# Altium project CW342_KintexK410_676.PrjPcb (part 1 of 2)
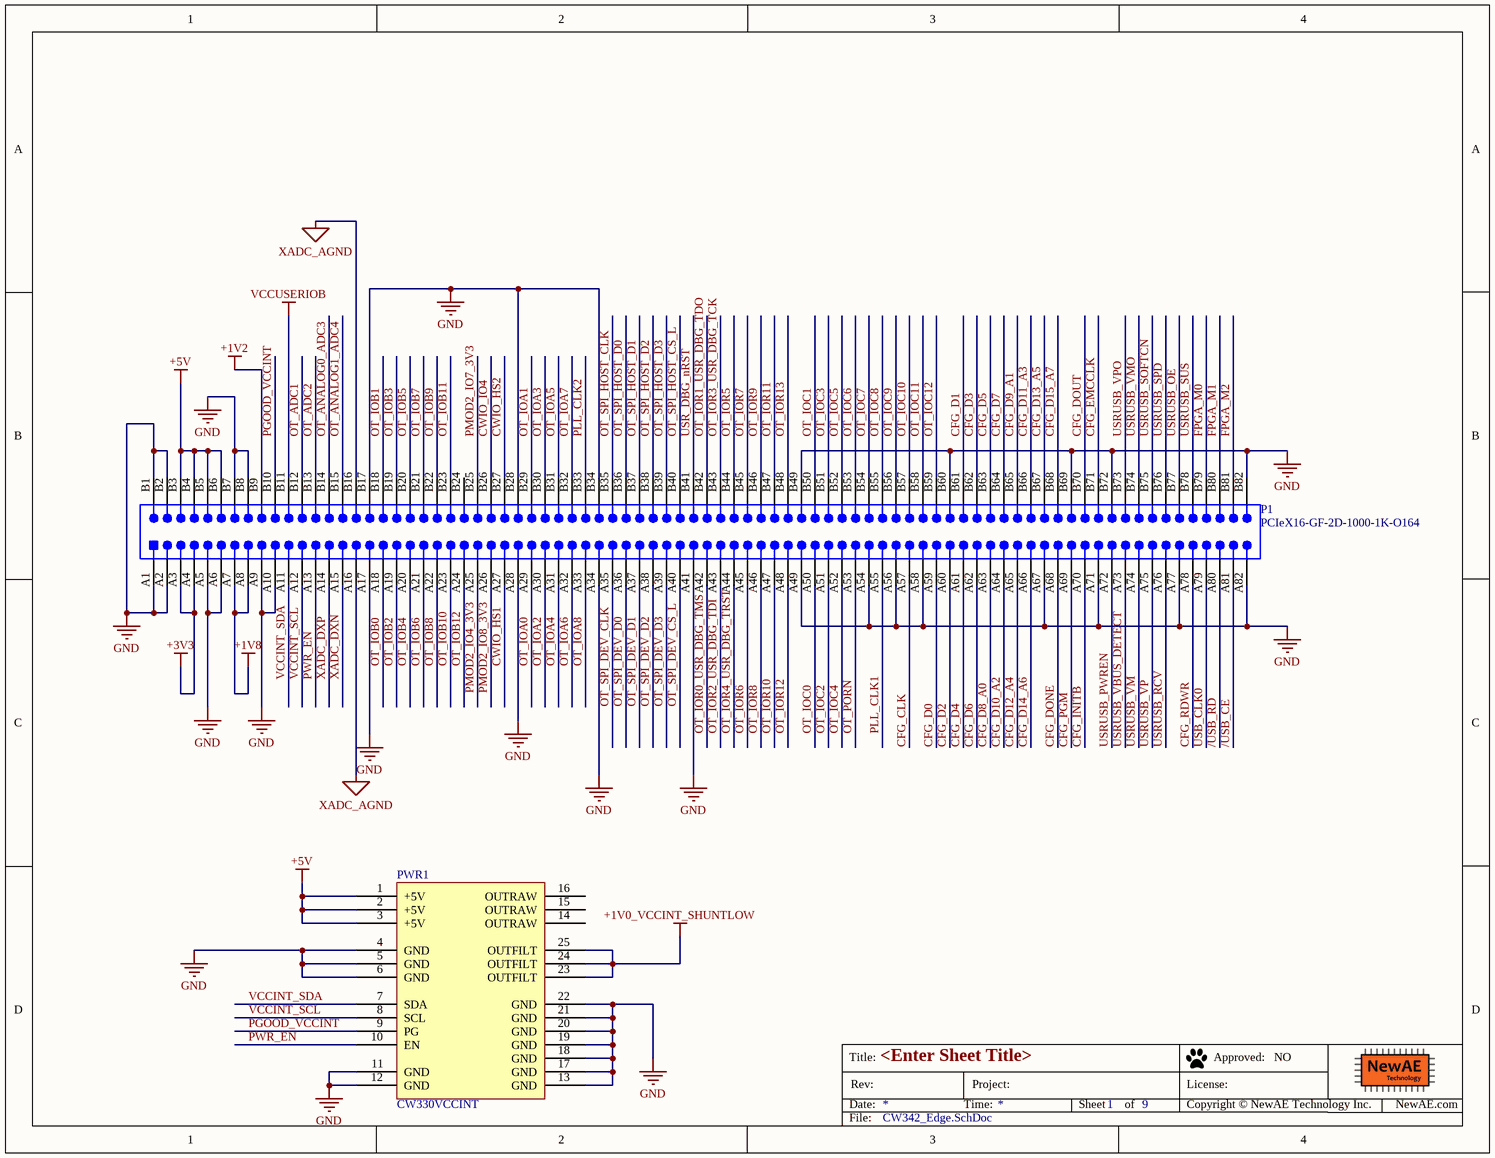
[diagram p0: CW342_Edge.SchDoc]
9 sheets, 90 parts. Net scope: global (net labels, ports and power ports of the same name join across sheets).
Board file: CW342_PCB.PcbDoc
Sheets:
  CW342_Edge.SchDoc
  CW342_XADC.SchDoc
  CW342_FPGAIO_1.SchDoc
  CW342_FPGIO_2.SchDoc
  CW342_FPGAIO_3.SchDoc
  CW342_FPGA_MGT.SchDoc
  CW342_FPGA_CFG.SchDoc
  CW342_FPGA_PWR.SchDoc
  CW342_FPGA_DECOUP.SchDoc

## Sheet CW342_Edge.SchDoc: <Enter Sheet Title>
size Letter; Organization: NewAE Technology Inc.; Address1: 1083 Queen St., Suite 196; Address2: Halifax; Address3: NS; Address4: Canada B3H 0B2; SheetNumber: 1; SheetTotal: 9; SheetApproved: NO

### Parts
P1  PCIeX16-GF-2D-1000-1K-O164  [PCIeX16-GF-2D-1000-1K-O164]
PWR1  CW330VCCINT  [CW335_VCCINT_POWERSUPPLY]

### Nets
+1V0_VCCINT_SHUNTLOW: PWR1.23(OUTFILT) PWR1.24(OUTFILT) PWR1.25(OUTFILT)
+1V2: P1.B9
+1V8: P1.A7 P1.A8
+3V3: P1.A3 P1.A4
+5V: P1.B3 P1.B4 P1.B5 P1.B6 PWR1.1(+5V) PWR1.2(+5V) PWR1.3(+5V)
GND: P1.A1 P1.A2 P1.A5 P1.A6 P1.A9 P1.A10 P1.A17 P1.A28 P1.A34 P1.A41 P1.A49 P1.A54 P1.A56 P1.A58 P1.A67 P1.A71 P1.A77 P1.A82 P1.B1 P1.B2 P1.B7 P1.B8 P1.B17 P1.B28 P1.B34 P1.B49 P1.B60 P1.B69 P1.B72 P1.B82 PWR1.4(GND) PWR1.5(GND) PWR1.6(GND) PWR1.11(GND) PWR1.12(GND) PWR1.13(GND) PWR1.17(GND) PWR1.18(GND) PWR1.19(GND) PWR1.20(GND) PWR1.21(GND) PWR1.22(GND)
VCCUSERIOB: P1.B11
XADC_AGND: P1.A16 P1.B16  [project net XADC_VREFN]
/USB_CE: P1.A81
/USB_RD: P1.A80
CFG_CLK: P1.A57
CFG_D0: P1.A59
CFG_D1: P1.B61
CFG_D2: P1.A60
CFG_D3: P1.B62
CFG_D4: P1.A61
CFG_D5: P1.B63
CFG_D6: P1.A62
CFG_D7: P1.B64
CFG_D8_A0: P1.A63
CFG_D9_A1: P1.B65
CFG_D10_A2: P1.A64
CFG_D11_A3: P1.B66
CFG_D12_A4: P1.A65
CFG_D13_A5: P1.B67
CFG_D14_A6: P1.A66
CFG_D15_A7: P1.B68
CFG_DONE: P1.A68
CFG_DOUT: P1.B70
CFG_EMCCLK: P1.B71
CFG_INITB: P1.A70
CFG_PGM: P1.A69
CFG_RDWR: P1.A78
CWIO_HS1: P1.A27
CWIO_HS2: P1.B27
CWIO_IO4: P1.B26
FPGA_M0: P1.B79
FPGA_M1: P1.B80
FPGA_M2: P1.B81
OT_ADC1: P1.B12
OT_ADC2: P1.B13
OT_ANALOG0_ADC3: P1.B14
OT_ANALOG1_ADC4: P1.B15
OT_IOA0: P1.A29
OT_IOA1: P1.B29
OT_IOA2: P1.A30
OT_IOA3: P1.B30
OT_IOA4: P1.A31
OT_IOA5: P1.B31
OT_IOA6: P1.A32
OT_IOA7: P1.B32
OT_IOA8: P1.A33
OT_IOB0: P1.A18
OT_IOB1: P1.B18
OT_IOB2: P1.A19
OT_IOB3: P1.B19
OT_IOB4: P1.A20
OT_IOB5: P1.B20
OT_IOB6: P1.A21
OT_IOB7: P1.B21
OT_IOB8: P1.A22
OT_IOB9: P1.B22
OT_IOB10: P1.A23
OT_IOB11: P1.B23
OT_IOB12: P1.A24
OT_IOC0: P1.A50
OT_IOC1: P1.B50
OT_IOC2: P1.A51
OT_IOC3: P1.B51
OT_IOC4: P1.A52
OT_IOC5: P1.B52
OT_IOC6: P1.B53
OT_IOC7: P1.B54
OT_IOC8: P1.B55
OT_IOC9: P1.B56
OT_IOC10: P1.B57
OT_IOC11: P1.B58
OT_IOC12: P1.B59
OT_IOR0_USR_DBG_TMS: P1.A42
OT_IOR1_USR_DBG_TDO: P1.B42
OT_IOR2_USR_DBG_TDI: P1.A43
OT_IOR3_USR_DBG_TCK: P1.B43
OT_IOR4_USR_DBG_TRST: P1.A44
OT_IOR5: P1.B44
OT_IOR6: P1.A45
OT_IOR7: P1.B45
OT_IOR8: P1.A46
OT_IOR9: P1.B46
OT_IOR10: P1.A47
OT_IOR11: P1.B47
OT_IOR12: P1.A48
OT_IOR13: P1.B48
OT_PORN: P1.A53
OT_SPI_DEV_CLK: P1.A35
OT_SPI_DEV_CS_L: P1.A40
OT_SPI_DEV_D0: P1.A36
OT_SPI_DEV_D1: P1.A37
OT_SPI_DEV_D2: P1.A38
OT_SPI_DEV_D3: P1.A39
OT_SPI_HOST_CLK: P1.B35
OT_SPI_HOST_CS_L: P1.B40
OT_SPI_HOST_D0: P1.B36
OT_SPI_HOST_D1: P1.B37
OT_SPI_HOST_D2: P1.B38
OT_SPI_HOST_D3: P1.B39
PGOOD_VCCINT: P1.B10 PWR1.9(PG)
PLL_CLK1: P1.A55
PLL_CLK2: P1.B33
PMOD2_IO4_3V3: P1.A25
PMOD2_IO7_3V3: P1.B25
PMOD2_IO8_3V3: P1.A26
PWR_EN: P1.A13 PWR1.10(EN)
USB_CLK0: P1.A79
USR_DBG_nRST: P1.B41
USRUSB_OE: P1.B77
USRUSB_PWREN: P1.A72
USRUSB_RCV: P1.A76
USRUSB_SOFTCN: P1.B75
USRUSB_SPD: P1.B76
USRUSB_SUS: P1.B78
USRUSB_VBUS_DETECT: P1.A73
USRUSB_VM: P1.A74
USRUSB_VMO: P1.B74
USRUSB_VP: P1.A75
USRUSB_VPO: P1.B73
VCCINT_SCL: P1.A12 PWR1.8(SCL)
VCCINT_SDA: P1.A11 PWR1.7(SDA)
XADC_DXN: P1.A15
XADC_DXP: P1.A14

Not connected (* = marked no-connect by the designer): P1 B24; PWR1 14(OUTRAW) 15(OUTRAW) 16(OUTRAW)

### Notes on the sheet
- Title:
- Date:
- Rev:
- Time:
- Project:
- Sheet
- of
- License:
- Copyright © NewAE Technology Inc.
- Approved:
- NewAE.com
- File:

### Library data of the parts
P1 = CMP-002-00047-1: Golden Finger, PCIeX16, Dual, Opposite, Pitch 1mm, 164-Position; Connector Type: EdgeConnector; Gender: Male; Mounting Technology: SM; Pins: 164; Case/Package: PCIeX16-GF-2D-1000-1K-O164; Package Description: Edge Connector, Golden Finger, Pitch 1 mm, 2 x 82 Position; Package Reference: PCIeX16-GF-2D-1000-1K-O164

## Sheet CW342_XADC.SchDoc: <Enter Sheet Title>
size Letter; Organization: NewAE Technology Inc.; Address1: 1083 Queen St., Suite 196; Address2: Halifax; Address3: NS; Address4: Canada B3H 0B2; SheetNumber: 2; SheetTotal: 9; SheetApproved: NO
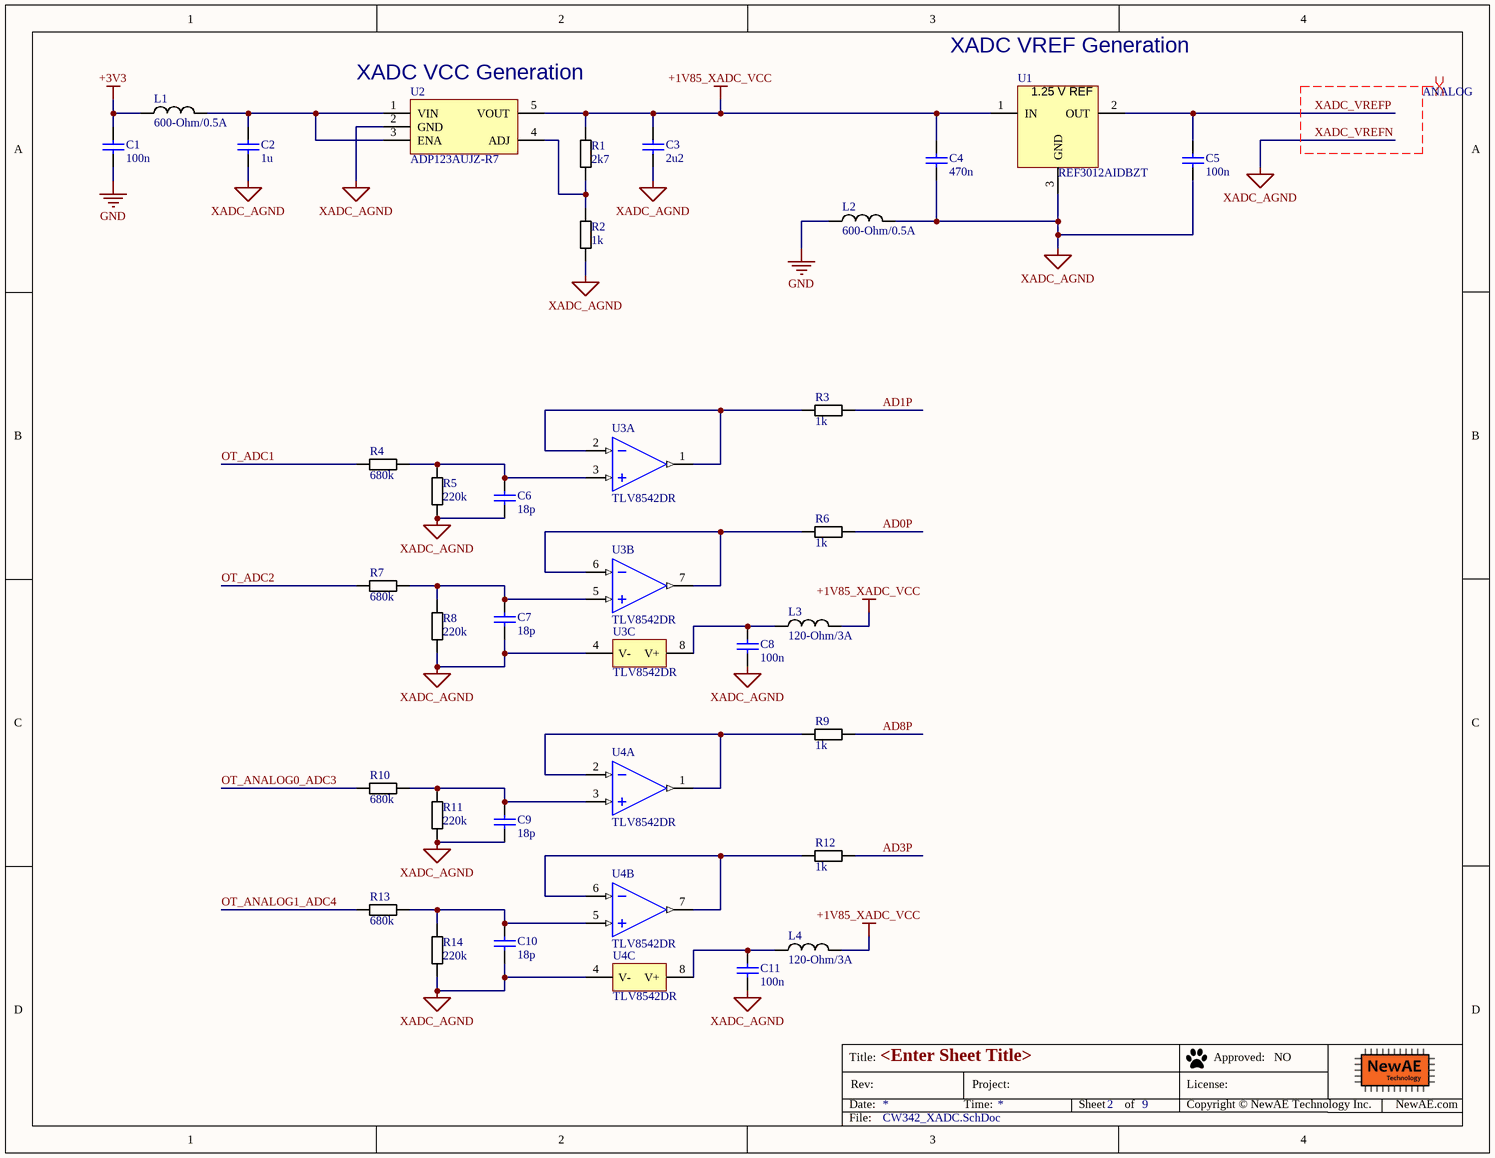
[diagram p1: CW342_XADC.SchDoc]

### Parts
C1  100n  [CAPC0402_M]
C2  1u  [CAPC0603_M]
C3  2u2  [CAPC0603_M]
C4  470n  [CAPC0603_M]
C5  100n  [CAPC0402_M]
C6  18p  [CAPC0402_M]
C7  18p  [CAPC0402_M]
C8  100n  [CAPC0402_M]
C9  18p  [CAPC0402_M]
C10  18p  [CAPC0402_M]
C11  100n  [CAPC0402_M]
L1  600-Ohm/0.5A  [IND_0603]
L2  600-Ohm/0.5A  [IND_0603]
L3  120-Ohm/3A  [IND_0603]
L4  120-Ohm/3A  [IND_0603]
R1  2k7  [RESC1005X40N]
R2  1k  [RESC1005X40N]
R3  1k  [RESC1005X40N]
R4  680k  [RESC1005X40N]
R5  220k  [RESC1005X40N]
R6  1k  [RESC1005X40N]
R7  680k  [RESC1005X40N]
R8  220k  [RESC1005X40N]
R9  1k  [RESC1005X40N]
R10  680k  [RESC1005X40N]
R11  220k  [RESC1005X40N]
R12  1k  [RESC1005X40N]
R13  680k  [RESC1005X40N]
R14  220k  [RESC1005X40N]
U1  REF3012AIDBZT  [SOT95P237X112-3N]
U2  Linear Voltage Regulator IC  1 Output  300mA TSOT-5  [SOT23-5P95_285X145L45X40]  (value not drawn)
U3  TLV8542DR  [SOIC127P600X175-8N]  (parts A,B,C of 3)
U4  TLV8542DR  [SOIC127P600X175-8N]  (parts A,B,C of 3)

### Nets
+1V85_XADC_VCC: C3.1 C4.1 L3.2 L4.2 R1.1 U1.1(IN) U2.5(VOUT)
+3V3: C1.1 L1.1
GND: C1.2 L2.1
XADC_VREFN: C2.2 C3.2 C4.2 C5.2 C6.2 C7.2 C8.2 C9.2 C10.2 C11.2 L2.2 R2.2 R5.2 R8.2 R11.2 R14.2 U1.3(GND) U2.2(GND) U3.4(V-) U4.4(V-)  [also labelled XADC_AGND]
AD0P: R6.2
AD1P: R3.2
AD3P: R12.2
AD8P: R9.2
OT_ADC1: R4.1
OT_ADC2: R7.1
OT_ANALOG0_ADC3: R10.1
OT_ANALOG1_ADC4: R13.1
XADC_VREFP: C5.1 U1.2(OUT)
NetC2_1: C2.1 L1.2 U2.1(VIN) U2.3(ENA)
NetC6_1: C6.1 R4.2 R5.1 U3.3(1_IN+)
NetC7_1: C7.1 R7.2 R8.1 U3.5(2_IN+)
NetC8_1: C8.1 L3.1 U3.8(V+)
NetC9_1: C9.1 R10.2 R11.1 U4.3(1_IN+)
NetC10_1: C10.1 R13.2 R14.1 U4.5(2_IN+)
NetC11_1: C11.1 L4.1 U4.8(V+)
NetR1_2: R1.2 R2.1 U2.4(ADJ)
NetR3_1: R3.1 U3.1(1_Out) U3.2(1_IN-)
NetR6_1: R6.1 U3.6(2_IN-) U3.7(2_Out)
NetR9_1: R9.1 U4.1(1_Out) U4.2(1_IN-)
NetR12_1: R12.1 U4.6(2_IN-) U4.7(2_Out)

### Layout directives
differential pair; differential pair class ANALOG: XADC_VREFN, XADC_VREFP

### Notes on the sheet
- (near U2) XADC VCC Generation
- XADC VREF Generation
- Title:
- Date:
- Rev:
- Time:
- Project:
- Sheet
- of
- License:
- Copyright © NewAE Technology Inc.
- Approved:
- NewAE.com
- File:
- (in symbol REF3012AIDBZT) 1.25 V REF

### Library data of the parts
C1 C5 C8 C11 = CCHIP-100n-0402: 100n, 0402; Manufacture Part Number 1: CGA2B3X7R1V104K050BB; Component Group: Capacitor; Case-EIA: 0402; Part Number: CCHIP-100n-0402; Footprint: 0402; Pin Count: 2; Value: 100n; Mounting Technology: SMT; Component Kind: Standard; Component Type: Standard; Supplier 1: Digi-Key; Supplier Part Number 1: 445-6901-1-ND
C2 = CCHIP-1u-0603: 1u, 0603, 50V; Manufacture Part Number 1: CL10A105KB8NNNC; Component Group: Capacitor; Case-EIA: 0603; Case-Metric: 1608; Rated Voltage: 50VDC; Part Number: CCHIP-1u-0603; Footprint: 0603; Pin Count: 2; Supplier 1: Digi-Key; Supplier Part Number 1: 1276-1860-1-ND; Value: 1u; Mounting Technology: SMT; Component Kind: Standard; Component Type: Standard
C3 = CCHIP-2u2-0603-25V: 2u2, 0603; Manufacture 1: Murata Electronics North America; Manufacture Part Number 1: GRM188R61E225MA12D; Component Group: Capacitor; Case-EIA: 0603; Case-Metric: 1608; Rated Voltage: 25VDC; Tolerance: ±20%; Part Number: CCHIP-2u2-0603-25V; Footprint: 0603; Pin Count: 2; Supplier 1: Digi-Key; Supplier Part Number 1: 490-12738-1-ND; Value: 2u2; Mounting Technology: SMT; RoHS: Yes; Component Kind: Standard; Component Type: Standard
C4 = CCHIP-470n-0603-50V: 470n, 0603, 50V; Manufacture 1: Taiyo Yuden; Manufacture Part Number 1: UMK107B7474KA-TR; Component Group: Capacitor; Case-EIA: 0603; Rated Voltage: 50VDC; Part Number: CCHIP-470n-0603-50V; Footprint: 0603; Pin Count: 2; Supplier 1: Digi-Key; Supplier Part Number 1: 587-3170-1-ND; Value: 470n; Mounting Technology: SMT; RoHS: Yes; Temperature Range: -55C to 125C; Component Kind: Standard; Component Type: Standard
C6 C7 C9 C10 = CCHIP-18p-0402: 18p, 0402; Manufacture Part Number 1: GRM1555C1H180JA01D; Component Group: Capacitor; Case-EIA: 0402; Part Number: CCHIP-18p-0402; Footprint: 0402; Pin Count: 2; Supplier 1: Digi-Key; Supplier Part Number 1: 490-5858-1-ND; Value: 18p; Mounting Technology: SMT; Component Kind: Standard; Component Type: Standard
L1 L2 = FBCHIP-600R-0603: 600 Ohm @ 100 MHz, 0.5A rated FB; Manufacture 1: Murata Electronics; Manufacture Part Number 1: BLM18AG601SN1D; Component Group: Inductor; Value: 600R/0.5A; Case-EIA: 0603; Case-Metric: 1608; PP Material Stack: 0; Part Number: FBCHIP-600R-0603; Footprint: 0603; Pin Count: 2; Supplier 1: Digi-Key; Supplier Part Number 1: 490-1014-2-ND; Rated Power: 0.5A; Component Kind: Standard; Component Type: Standard; PP Rotation: 0
L3 L4 = FBCHIP-120R-0603: 120 Ohm @ 100 MHz, 3A rated FB; Manufacture 1: Murata Electronics; Manufacture Part Number 1: BLM18SG121TN1D; Component Group: Inductor; Value: 120R/3A; Case-EIA: 0603; Case-Metric: 1680; PP Material Stack: 0; Part Number: FBCHIP-120R-0603; Footprint: 0603; Pin Count: 2; Supplier 1: Digi-Key; Supplier Part Number 1: 490-3996-1-ND; Rated Power: 3A; Component Kind: Standard; Component Type: Standard; PP Rotation: 0
R1 = RCHIP-2K7-0402: 2k7 res, 0402, 1%, 1/16W; Manufacture 1: Yageo; Manufacture Part Number 1: RC0402FR-072K7L; Component Group: Resistor; Case-EIA: 0402; Case-Metric: 1005; Rated Power: 0.063W; Rated Voltage: 75VDC; Part Number: RCHIP-2K7-0402; Footprint: 0402; Pin Count: 2; Supplier 1: Digi-Key; Supplier Part Number 1: 311-2.70KLRCT-ND; Value: 2k7; Tolerance: 1%; Mounting Technology: SMT; Temperature Range: -55C to 155C; Component Kind: Standard; Component Type: Standard
R2 R3 R6 R9 R12 = RCHIP-1K-0402: 1k res, 0402, 1%, 1/16W; Manufacture 1: Yageo; Manufacture Part Number 1: RC0402FR-071KL; Component Group: Resistor; Case-EIA: 0402; Case-Metric: 1005; Rated Power: 0.063W; Rated Voltage: 75VDC; Part Number: RCHIP-1K-0402; Footprint: 0402; Pin Count: 2; Supplier 1: Digi-Key; Supplier Part Number 1: 311-1.00KLRCT-ND; Value: 1k; Tolerance: 1%; Mounting Technology: SMT; Temperature Range: -55C to 155C; Component Kind: Standard; Component Type: Standard
R4 R7 R10 R13 = RCHIP-680K-0402: 680k res, 0402, 1%, 1/16W; Manufacture 1: Yageo; Manufacture Part Number 1: RC0402FR-07680KL; Component Group: Resistor; Case-EIA: 0402; Case-Metric: 1005; Rated Power: 0.063W; Rated Voltage: 75VDC; Part Number: RCHIP-680K-0402; Footprint: 0402; Pin Count: 2; Supplier 1: Digi-Key; Supplier Part Number 1: YAG3211CT-ND; Value: 680k; Tolerance: 1%; Mounting Technology: SMT; Temperature Range: -55C to 155C; Component Kind: Standard; Component Type: Standard
R5 R8 R11 R14 = RCHIP-220K-0402: 220k res, 0402, 1%, 1/16W; Manufacture 1: Yageo; Manufacture Part Number 1: RC0402FR-07220KL; Component Group: Resistor; Case-EIA: 0402; Case-Metric: 1005; Rated Power: 0.063W; Rated Voltage: 75VDC; Part Number: RCHIP-220K-0402; Footprint: 0402; Pin Count: 2; Supplier 1: Digi-Key; Supplier Part Number 1: 311-220KLRCT-ND; Value: 220k; Tolerance: 1%; Mounting Technology: SMT; Temperature Range: -55C to 155C; Component Kind: Standard; Component Type: Standard
U1 = REF3012AIDBZT: IC VREF SERIES 0.2% SOT23-3; Manufacture 1: Texas Instruments; Output Voltage: 1.25V; Max Input Voltage: 5.5V; Max Output Current: 25mA; Min Input Voltage: 1.8V; Nominal Supply Current: 42uA; Temperature Coefficient: 50ppm/°C; Number of Channels: 1; Quiescent Current: 50uA; Min Output Voltage: 1.248V; Reference Type: Series,Fixed; Component Group: Analog IC; PP Material Stack: 0; Supplier 1: Digi-Key; RoHS: Yes; Category: Voltage References; Stock 1: 7831; Pricing 1: 1=1.18000, 10=1.05300, 25=0.99960, 100=0.76760 (USD); Case/Package: SOT-23; Number of Pins: 3; Min Operating Temperature: -40°C; Max Operating Temperature: 125°C; Packaging: Tape and Reel; Package Quantity: 1; Output Current: 25mA; Max Supply Current: 50uA; Max Output Voltage: 1.25V; Reference Voltage: 1.25V; Termination: SMD/SMT; Length: 2.92mm; Width: 1.3mm; Height: 1mm; Radiation Hardening: No; REACH SVHC: No SVHC; Lead Free: Lead Free; ComponentLink3URL: https://datasheet.ciiva.com/2007/ref3012-2007154.pdf?src-supplier=Digi-Key; ComponentLink3Description: https://datasheet.ciiva.com/2007/ref3012-2007154.pdf?src-supplier=Digi-Key; ComponentLink4URL: https://datasheet.ciiva.com/2007/ref3012-2007155.pdf?src-supplier=Digi-Key; ComponentLink4Description: https://datasheet.ciiva.com/2007/ref3012-2007155.pdf?src-supplier=Digi-Key; ComponentLink5URL: https://datasheet.ciiva.com/3235/ref3033-3235533.pdf?src-supplier=Avnet; ComponentLink5Description: https://datasheet.ciiva.com/3235/ref3033-3235533.pdf?src-supplier=Avnet; ComponentLink6URL: https://datasheet.ciiva.com/3235/ref3033-3235534.pdf?src-supplier=Avnet; ComponentLink6Description: https://datasheet.ciiva.com/3235/ref3033-3235534.pdf?src-supplier=Avnet; .Checked SCH: *; .Checked PCB: *; Supplier Part Number 1: REF3012AIDBZTTR-ND; Manufacturer Part Number: REF3012AIDBZT; Part Number: REF3012AIDBZT; Footprint: SOT23-3; Manufacture Part Number 1: REF3012AIDBZT; Pin Count: 3; Mounting Technology: SMT; Component Kind: Standard; Component Type: Standard; PP Rotation: 0
U2 = ADP123AUJZ-R7: IC REG LIN POS ADJ 300MA TSOT5; Manufacture 1: Analog Devices Inc.; Dropout Voltage: 85mV; Output Voltage: 5V; Number of Outputs: 1; Max Input Voltage: 5.5V; Min Input Voltage: 2.3V; Min Current Limit: 350mA; Polarity: Positive; Quiescent Current: 45uA; Reference Voltage: 500mV; Min Output Voltage: 800mV; Accuracy: 1%; Power Supply Rejection Ratio (PSRR): 60dB; Max Supply Current: 170uA; Output Type: Adjustable; Component Group: Analog IC; PP Material Stack: 0; Supplier 1: Digi-Key; Category: Voltage Regulators - Linear; Stock 1: 14167; Pricing 1: 1=1.16000, 10=1.03300, 25=0.98000, 100=0.75250, 250=0.66500, 500=0.63000, 1000=0.49000 (USD); Case/Package: TSOT; Number of Pins: 5; Contact Plating: Tin,Matte; Min Operating Temperature: -40°C; Max Operating Temperature: 125°C; Output Current: 300mA; Max Output Current: 300mA; Packaging: Tape and Reel; Number of Regulators: 1; Max Output Voltage: 5V; Output Voltage Accuracy: 1%; Nominal Supply Current: 45uA; Operating Supply Current: 45uA; Length: 2.9mm; Width: 1.6mm; Height: 0.9mm; REACH SVHC: No SVHC; Lead Free: Contains Lead; ComponentLink3URL: https://datasheet.ciiva.com/2040/adp122-123-2040698.pdf?src-supplier=Digi-Key; ComponentLink3Description: https://datasheet.ciiva.com/2040/adp122-123-2040698.pdf?src-supplier=Digi-Key; ComponentLink4URL: https://datasheet.ciiva.com/2040/adp122-123-2040699.pdf?src-supplier=Digi-Key; ComponentLink4Description: https://datasheet.ciiva.com/2040/adp122-123-2040699.pdf?src-supplier=Digi-Key; Supplier Part Number 1: ADP123AUJZ-R7TR-ND; .Checked SCH: *; .Checked PCB: *; Manufacturer Part Number: ADP123AUJZ-R7; Part Number: ADP123AUJZ-R7; Manufacture Part Number 1: ADP123AUJZ-R7; Pin Count: 5; Mounting Technology: SMT; Component Kind: Standard; Component Type: Standard; PP Rotation: 0; Footprint: SOT23-5
U3 U4 = LM2904_SOIC8: IC OP-AMP GP; Manufacture 1: Texas Instruments; Component Group: Analog IC; PP Material Stack: 0; Part Number: LM2904_SOIC8; Footprint: SOIC8; Manufacture Part Number 1: TLV8542DR; Pin Count: 8; Supplier 1: Digi-Key; Supplier Part Number 1: 296-48991-1-ND; Mounting Technology: SMT; RoHS: Yes; Component Kind: Standard; Component Type: Standard; PP Rotation: 0

## Sheet CW342_FPGAIO_1.SchDoc: <Enter Sheet Title>
size Letter; Organization: NewAE Technology Inc.; Address1: 1083 Queen St., Suite 196; Address2: Halifax; Address3: NS; Address4: Canada B3H 0B2; SheetNumber: 3; SheetTotal: 9; SheetApproved: NO
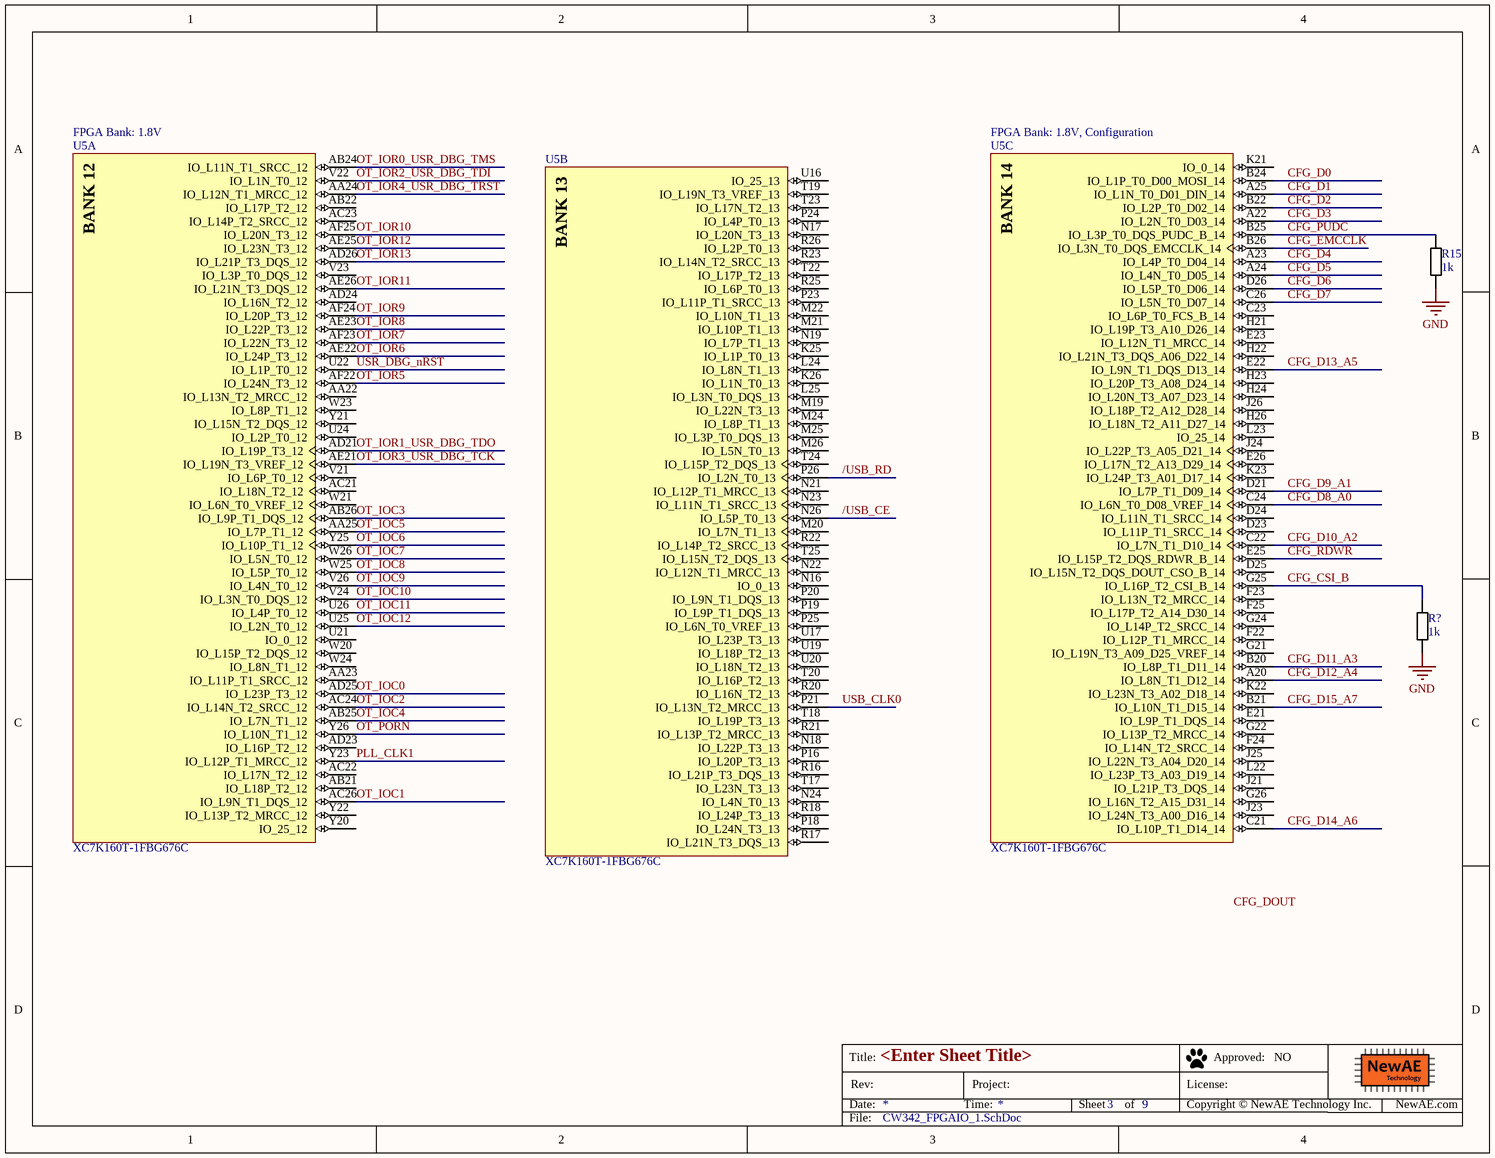
[diagram p2: CW342_FPGAIO_1.SchDoc]

### Parts
R15  1k  [RESC1005X40N]
R?  1k  [RESC1005X40N]
U5  XC7K160T-1FBG676C  [FBG676]  (parts A,B,C of 14)

### Nets
GND: R15.2 R?.2
/USB_CE: U5.N26(IO_L5P_T0_13)
/USB_RD: U5.P26(IO_L2N_T0_13)
CFG_CSI_B: R?.1 U5.G25(IO_L16P_T2_CSI_B_14)
CFG_D0: U5.B24(IO_L1P_T0_D00_MOSI_14)
CFG_D1: U5.A25(IO_L1N_T0_D01_DIN_14)
CFG_D2: U5.B22(IO_L2P_T0_D02_14)
CFG_D3: U5.A22(IO_L2N_T0_D03_14)
CFG_D4: U5.A23(IO_L4P_T0_D04_14)
CFG_D5: U5.A24(IO_L4N_T0_D05_14)
CFG_D6: U5.D26(IO_L5P_T0_D06_14)
CFG_D7: U5.C26(IO_L5N_T0_D07_14)
CFG_D8_A0: U5.C24(IO_L6N_T0_D08_VREF_14)
CFG_D9_A1: U5.D21(IO_L7P_T1_D09_14)
CFG_D10_A2: U5.C22(IO_L7N_T1_D10_14)
CFG_D11_A3: U5.B20(IO_L8P_T1_D11_14)
CFG_D12_A4: U5.A20(IO_L8N_T1_D12_14)
CFG_D13_A5: U5.E22(IO_L9N_T1_DQS_D13_14)
CFG_D14_A6: U5.C21(IO_L10P_T1_D14_14)
CFG_D15_A7: U5.B21(IO_L10N_T1_D15_14)
CFG_EMCCLK: U5.B26(IO_L3N_T0_DQS_EMCCLK_14)
CFG_PUDC: R15.1 U5.B25(IO_L3P_T0_DQS_PUDC_B_14)
CFG_RDWR: U5.E25(IO_L15P_T2_DQS_RDWR_B_14)
OT_IOC0: U5.AD25(IO_L23P_T3_12)
OT_IOC1: U5.AC26(IO_L9N_T1_DQS_12)
OT_IOC2: U5.AC24(IO_L14N_T2_SRCC_12)
OT_IOC3: U5.AB26(IO_L9P_T1_DQS_12)
OT_IOC4: U5.AB25(IO_L7N_T1_12)
OT_IOC5: U5.AA25(IO_L7P_T1_12)
OT_IOC6: U5.Y25(IO_L10P_T1_12)
OT_IOC7: U5.W26(IO_L5N_T0_12)
OT_IOC8: U5.W25(IO_L5P_T0_12)
OT_IOC9: U5.V26(IO_L4N_T0_12)
OT_IOC10: U5.V24(IO_L3N_T0_DQS_12)
OT_IOC11: U5.U26(IO_L4P_T0_12)
OT_IOC12: U5.U25(IO_L2N_T0_12)
OT_IOR0_USR_DBG_TMS: U5.AB24(IO_L11N_T1_SRCC_12)
OT_IOR1_USR_DBG_TDO: U5.AD21(IO_L19P_T3_12)
OT_IOR2_USR_DBG_TDI: U5.V22(IO_L1N_T0_12)
OT_IOR3_USR_DBG_TCK: U5.AE21(IO_L19N_T3_VREF_12)
OT_IOR4_USR_DBG_TRST: U5.AA24(IO_L12N_T1_MRCC_12)
OT_IOR5: U5.AF22(IO_L24N_T3_12)
OT_IOR6: U5.AE22(IO_L24P_T3_12)
OT_IOR7: U5.AF23(IO_L22N_T3_12)
OT_IOR8: U5.AE23(IO_L22P_T3_12)
OT_IOR9: U5.AF24(IO_L20P_T3_12)
OT_IOR10: U5.AF25(IO_L20N_T3_12)
OT_IOR11: U5.AE26(IO_L21N_T3_DQS_12)
OT_IOR12: U5.AE25(IO_L23N_T3_12)
OT_IOR13: U5.AD26(IO_L21P_T3_DQS_12)
OT_PORN: U5.Y26(IO_L10N_T1_12)
PLL_CLK1: U5.Y23(IO_L12P_T1_MRCC_12)
USB_CLK0: U5.P21(IO_L13N_T2_MRCC_13)
USR_DBG_nRST: U5.U22(IO_L1P_T0_12)

Not connected (* = marked no-connect by the designer): U5 AA22(IO_L13N_T2_MRCC_12) AA23(IO_L11P_T1_SRCC_12) AB21(IO_L18P_T2_12) AB22(IO_L17P_T2_12) AC21(IO_L18N_T2_12) AC22(IO_L17N_T2_12) AC23(IO_L14P_T2_SRCC_12) AD23(IO_L16P_T2_12) AD24(IO_L16N_T2_12) C23(IO_L6P_T0_FCS_B_14) D23(IO_L11P_T1_SRCC_14) D24(IO_L11N_T1_SRCC_14) D25(IO_L15N_T2_DQS_DOUT_CSO_B_14) E21(IO_L9P_T1_DQS_14) E23(IO_L12N_T1_MRCC_14) E26(IO_L17N_T2_A13_D29_14) F22(IO_L12P_T1_MRCC_14) F23(IO_L13N_T2_MRCC_14) F24(IO_L14N_T2_SRCC_14) F25(IO_L17P_T2_A14_D30_14) G21(IO_L19N_T3_A09_D25_VREF_14) G22(IO_L13P_T2_MRCC_14) G24(IO_L14P_T2_SRCC_14) G26(IO_L16N_T2_A15_D31_14) H21(IO_L19P_T3_A10_D26_14) H22(IO_L21N_T3_DQS_A06_D22_14) H23(IO_L20P_T3_A08_D24_14) H24(IO_L20N_T3_A07_D23_14) H26(IO_L18N_T2_A11_D27_14) J21(IO_L21P_T3_DQS_14) J23(IO_L24N_T3_A00_D16_14) J24(IO_L22P_T3_A05_D21_14) J25(IO_L22N_T3_A04_D20_14) J26(IO_L18P_T2_A12_D28_14) K21(IO_0_14) K22(IO_L23N_T3_A02_D18_14) K23(IO_L24P_T3_A01_D17_14) K25(IO_L1P_T0_13) K26(IO_L1N_T0_13) L22(IO_L23P_T3_A03_D19_14) L23(IO_25_14) L24(IO_L8N_T1_13) L25(IO_L3N_T0_DQS_13) M19(IO_L22N_T3_13) M20(IO_L7N_T1_13) M21(IO_L10P_T1_13) M22(IO_L10N_T1_13) M24(IO_L8P_T1_13) M25(IO_L3P_T0_DQS_13) M26(IO_L5N_T0_13) N16(IO_0_13) N17(IO_L20N_T3_13) N18(IO_L22P_T3_13) N19(IO_L7P_T1_13) N21(IO_L12P_T1_MRCC_13) N22(IO_L12N_T1_MRCC_13) N23(IO_L11N_T1_SRCC_13) N24(IO_L4N_T0_13) P16(IO_L20P_T3_13) P18(IO_L24N_T3_13) P19(IO_L9P_T1_DQS_13) P20(IO_L9N_T1_DQS_13) P23(IO_L11P_T1_SRCC_13) P24(IO_L4P_T0_13) P25(IO_L6N_T0_VREF_13) R16(IO_L21P_T3_DQS_13) R17(IO_L21N_T3_DQS_13) R18(IO_L24P_T3_13) R20(IO_L16N_T2_13) R21(IO_L13P_T2_MRCC_13) R22(IO_L14P_T2_SRCC_13) R23(IO_L14N_T2_SRCC_13) R25(IO_L6P_T0_13) R26(IO_L2P_T0_13) T17(IO_L23N_T3_13) T18(IO_L19P_T3_13) T19(IO_L19N_T3_VREF_13) T20(IO_L16P_T2_13) T22(IO_L17P_T2_13) T23(IO_L17N_T2_13) T24(IO_L15P_T2_DQS_13) T25(IO_L15N_T2_DQS_13) U16(IO_25_13) U17(IO_L23P_T3_13) U19(IO_L18P_T2_13) U20(IO_L18N_T2_13) U21(IO_0_12) U24(IO_L2P_T0_12) V21(IO_L6P_T0_12) V23(IO_L3P_T0_DQS_12) W20(IO_L15P_T2_DQS_12) W21(IO_L6N_T0_VREF_12) W23(IO_L8P_T1_12) W24(IO_L8N_T1_12) Y20(IO_25_12) Y21(IO_L15N_T2_DQS_12) Y22(IO_L13P_T2_MRCC_12)

### Notes on the sheet
- FPGA Bank: 1.8V
- FPGA Bank: 1.8V, Configuration
- Labels drawn without touching a wire or pin: CFG_DOUT
- Title:
- Date:
- Rev:
- Time:
- Project:
- Sheet
- of
- License:
- Copyright © NewAE Technology Inc.
- Approved:
- NewAE.com
- File:
- (in symbol CMP-0361-00025-2, part A) BANK 12
- (in symbol CMP-0361-00025-2, part B) BANK 13
- (in symbol CMP-0361-00025-2, part C) BANK 14

### Library data of the parts
R15 R? = RCHIP-1K-0402: as R2 on sheet CW342_XADC; Part Number: RCHIP-1K-0402; Footprint: 0402; Pin Count: 2; Supplier 1: Digi-Key; Supplier Part Number 1: 311-1.00KLRCT-ND; Value: 1k; Tolerance: 1%; Mounting Technology: SMT; Temperature Range: -55C to 155C; Component Kind: Standard; Component Type: Standard
U5 = CMP-0361-00025-2: Kintex-7 FPGA, 400 User I/Os, 8 GTX, 676-Ball BGA, Speed Grade 1, Commercial Grade, Pb-Free; Manufacturer: Xilinx; SelectIO HR: 250; GTX: 8; SelectIO HP: 150; Speed Grade: -1; RoHS: Pb-Free; PackageReference: FBG676; Code_JEDEC: MS-034; Mounting Technology: Surface Mount; ComponentLink1URL: http://www.xilinx.com/support/documentation/data_sheets/ds180_7Series_Overview.pdf; DatasheetVersion: v1.12; Generic Part Number: XC7K160T; PartNumber: XC7K160T-1FBG676C; PackageVersion: Rev 1.8; ComponentLink2URL: http://www.xilinx.com/support/documentation/user_guides/ug475_7Series_Pkg_Pinout.pdf; PackageDescription: Flip-Chip Lidless BGA, Body 27 x 27 mm, 1.0 mm Pitch; ComponentLink1Description: Datasheet; ComponentLink2Description: Package Specification

## Sheet CW342_FPGIO_2.SchDoc: <Enter Sheet Title>
size Letter; Organization: NewAE Technology Inc.; Address1: 1083 Queen St., Suite 196; Address2: Halifax; Address3: NS; Address4: Canada B3H 0B2; SheetNumber: 4; SheetTotal: 9; SheetApproved: NO
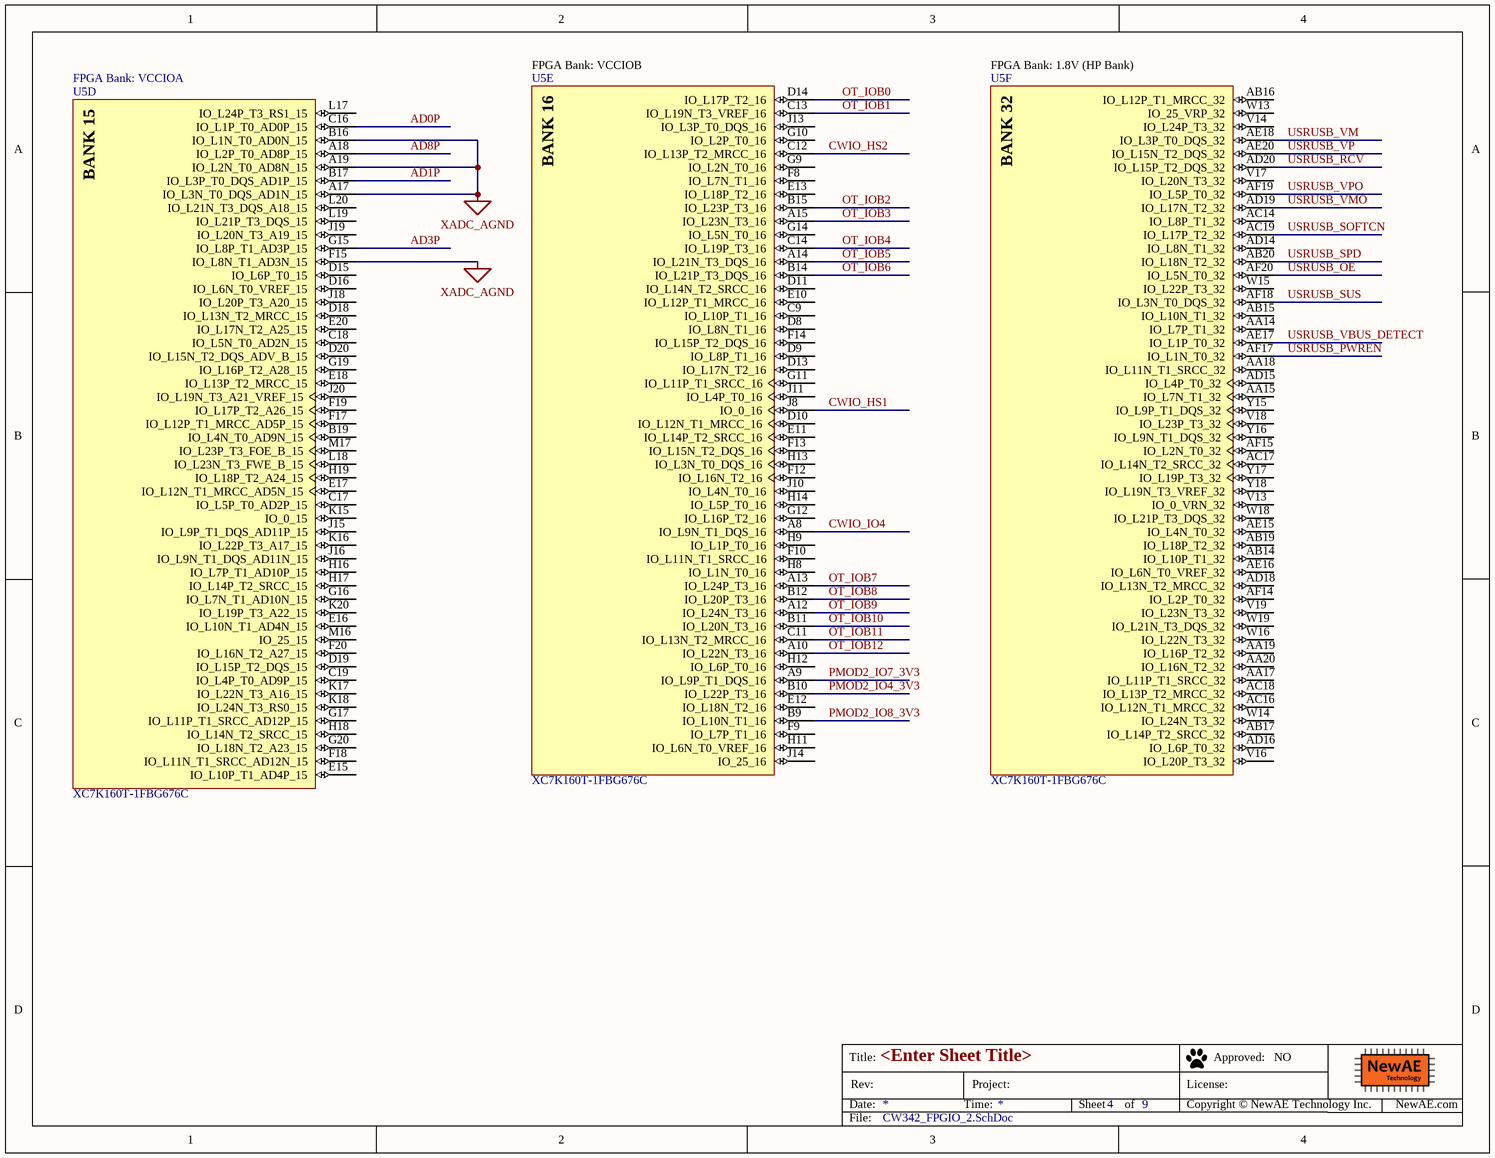
[diagram p3: CW342_FPGIO_2.SchDoc]

### Parts
U5  XC7K160T-1FBG676C  [FBG676]  (parts D,E,F of 14)

### Nets
XADC_AGND: U5.A17(IO_L3N_T0_DQS_AD1N_15) U5.A19(IO_L2N_T0_AD8N_15) U5.B16(IO_L1N_T0_AD0N_15) U5.F15(IO_L8N_T1_AD3N_15)  [project net XADC_VREFN]
AD0P: U5.C16(IO_L1P_T0_AD0P_15)
AD1P: U5.B17(IO_L3P_T0_DQS_AD1P_15)
AD3P: U5.G15(IO_L8P_T1_AD3P_15)
AD8P: U5.A18(IO_L2P_T0_AD8P_15)
CWIO_HS1: U5.J8(IO_0_16)
CWIO_HS2: U5.C12(IO_L13P_T2_MRCC_16)
CWIO_IO4: U5.A8(IO_L9N_T1_DQS_16)
OT_IOB0: U5.D14(IO_L17P_T2_16)
OT_IOB1: U5.C13(IO_L19N_T3_VREF_16)
OT_IOB2: U5.B15(IO_L23P_T3_16)
OT_IOB3: U5.A15(IO_L23N_T3_16)
OT_IOB4: U5.C14(IO_L19P_T3_16)
OT_IOB5: U5.A14(IO_L21N_T3_DQS_16)
OT_IOB6: U5.B14(IO_L21P_T3_DQS_16)
OT_IOB7: U5.A13(IO_L24P_T3_16)
OT_IOB8: U5.B12(IO_L20P_T3_16)
OT_IOB9: U5.A12(IO_L24N_T3_16)
OT_IOB10: U5.B11(IO_L20N_T3_16)
OT_IOB11: U5.C11(IO_L13N_T2_MRCC_16)
OT_IOB12: U5.A10(IO_L22N_T3_16)
PMOD2_IO4_3V3: U5.B10(IO_L22P_T3_16)
PMOD2_IO7_3V3: U5.A9(IO_L9P_T1_DQS_16)
PMOD2_IO8_3V3: U5.B9(IO_L10N_T1_16)
USRUSB_OE: U5.AF20(IO_L5N_T0_32)
USRUSB_PWREN: U5.AF17(IO_L1N_T0_32)
USRUSB_RCV: U5.AD20(IO_L15P_T2_DQS_32)
USRUSB_SOFTCN: U5.AC19(IO_L17P_T2_32)
USRUSB_SPD: U5.AB20(IO_L18N_T2_32)
USRUSB_SUS: U5.AF18(IO_L3N_T0_DQS_32)
USRUSB_VBUS_DETECT: U5.AE17(IO_L1P_T0_32)
USRUSB_VM: U5.AE18(IO_L3P_T0_DQS_32)
USRUSB_VMO: U5.AD19(IO_L17N_T2_32)
USRUSB_VP: U5.AE20(IO_L15N_T2_DQS_32)
USRUSB_VPO: U5.AF19(IO_L5P_T0_32)

Not connected (* = marked no-connect by the designer): U5 AA14(IO_L7P_T1_32) AA15(IO_L7N_T1_32) AA17(IO_L11P_T1_SRCC_32) AA18(IO_L11N_T1_SRCC_32) AA19(IO_L16P_T2_32) AA20(IO_L16N_T2_32) AB14(IO_L10P_T1_32) AB15(IO_L10N_T1_32) AB16(IO_L12P_T1_MRCC_32) AB17(IO_L14P_T2_SRCC_32) AB19(IO_L18P_T2_32) AC14(IO_L8P_T1_32) AC16(IO_L12N_T1_MRCC_32) AC17(IO_L14N_T2_SRCC_32) AC18(IO_L13P_T2_MRCC_32) AD14(IO_L8N_T1_32) AD15(IO_L4P_T0_32) AD16(IO_L6P_T0_32) AD18(IO_L13N_T2_MRCC_32) AE15(IO_L4N_T0_32) AE16(IO_L6N_T0_VREF_32) AF14(IO_L2P_T0_32) AF15(IO_L2N_T0_32) B19(IO_L4N_T0_AD9N_15) C9(IO_L10P_T1_16) C17(IO_L5P_T0_AD2P_15) C18(IO_L5N_T0_AD2N_15) C19(IO_L4P_T0_AD9P_15) D8(IO_L8N_T1_16) D9(IO_L8P_T1_16) D10(IO_L12N_T1_MRCC_16) D11(IO_L14N_T2_SRCC_16) D13(IO_L17N_T2_16) D15(IO_L6P_T0_15) D16(IO_L6N_T0_VREF_15) D18(IO_L13N_T2_MRCC_15) D19(IO_L15P_T2_DQS_15) D20(IO_L15N_T2_DQS_ADV_B_15) E10(IO_L12P_T1_MRCC_16) E11(IO_L14P_T2_SRCC_16) E12(IO_L18N_T2_16) E13(IO_L18P_T2_16) E15(IO_L10P_T1_AD4P_15) E16(IO_L10N_T1_AD4N_15) E17(IO_L12N_T1_MRCC_AD5N_15) E18(IO_L13P_T2_MRCC_15) E20(IO_L17N_T2_A25_15) F8(IO_L7N_T1_16) F9(IO_L7P_T1_16) F10(IO_L11N_T1_SRCC_16) F12(IO_L16N_T2_16) F13(IO_L15N_T2_DQS_16) F14(IO_L15P_T2_DQS_16) F17(IO_L12P_T1_MRCC_AD5P_15) F18(IO_L11N_T1_SRCC_AD12N_15) F19(IO_L17P_T2_A26_15) F20(IO_L16N_T2_A27_15) G9(IO_L2N_T0_16) G10(IO_L2P_T0_16) G11(IO_L11P_T1_SRCC_16) G12(IO_L16P_T2_16) G14(IO_L5N_T0_16) G16(IO_L7N_T1_AD10N_15) G17(IO_L11P_T1_SRCC_AD12P_15) G19(IO_L16P_T2_A28_15) G20(IO_L18N_T2_A23_15) H8(IO_L1N_T0_16) H9(IO_L1P_T0_16) H11(IO_L6N_T0_VREF_16) H12(IO_L6P_T0_16) H13(IO_L3N_T0_DQS_16) H14(IO_L5P_T0_16) H16(IO_L7P_T1_AD10P_15) H17(IO_L14P_T2_SRCC_15) H18(IO_L14N_T2_SRCC_15) H19(IO_L18P_T2_A24_15) J10(IO_L4N_T0_16) J11(IO_L4P_T0_16) J13(IO_L3P_T0_DQS_16) J14(IO_25_16) J15(IO_L9P_T1_DQS_AD11P_15) J16(IO_L9N_T1_DQS_AD11N_15) J18(IO_L20P_T3_A20_15) J19(IO_L20N_T3_A19_15) J20(IO_L19N_T3_A21_VREF_15) K15(IO_0_15) K16(IO_L22P_T3_A17_15) K17(IO_L22N_T3_A16_15) K18(IO_L24N_T3_RS0_15) K20(IO_L19P_T3_A22_15) L17(IO_L24P_T3_RS1_15) L18(IO_L23N_T3_FWE_B_15) L19(IO_L21P_T3_DQS_15) L20(IO_L21N_T3_DQS_A18_15) M16(IO_25_15) M17(IO_L23P_T3_FOE_B_15) V13(IO_0_VRN_32) V14(IO_L24P_T3_32) V16(IO_L20P_T3_32) V17(IO_L20N_T3_32) V18(IO_L23P_T3_32) V19(IO_L23N_T3_32) W13(IO_25_VRP_32) W14(IO_L24N_T3_32) W15(IO_L22P_T3_32) W16(IO_L22N_T3_32) W18(IO_L21P_T3_DQS_32) W19(IO_L21N_T3_DQS_32) Y15(IO_L9P_T1_DQS_32) Y16(IO_L9N_T1_DQS_32) Y17(IO_L19P_T3_32) Y18(IO_L19N_T3_VREF_32)

### Notes on the sheet
- FPGA Bank: VCCIOA
- FPGA Bank: VCCIOB
- (near U5) FPGA Bank: 1.8V (HP Bank)
- Title:
- Date:
- Rev:
- Time:
- Project:
- Sheet
- of
- License:
- Copyright © NewAE Technology Inc.
- Approved:
- NewAE.com
- File:
- (in symbol CMP-0361-00025-2, part D) BANK 15
- (in symbol CMP-0361-00025-2, part E) BANK 16
- (in symbol CMP-0361-00025-2, part F) BANK 32

### Library data of the parts
U5 = CMP-0361-00025-2: as U5 on sheet CW342_FPGAIO_1; RoHS: Pb-Free; PackageReference: FBG676; Code_JEDEC: MS-034; Mounting Technology: Surface Mount; ComponentLink1URL: http://www.xilinx.com/support/documentation/data_sheets/ds180_7Series_Overview.pdf; DatasheetVersion: v1.12; Generic Part Number: XC7K160T; PartNumber: XC7K160T-1FBG676C; PackageVersion: Rev 1.8; ComponentLink2URL: http://www.xilinx.com/support/documentation/user_guides/ug475_7Series_Pkg_Pinout.pdf; PackageDescription: Flip-Chip Lidless BGA, Body 27 x 27 mm, 1.0 mm Pitch; ComponentLink1Description: Datasheet; ComponentLink2Description: Package Specification

## Sheet CW342_FPGAIO_3.SchDoc: <Enter Sheet Title>
size Letter; Organization: NewAE Technology Inc.; Address1: 1083 Queen St., Suite 196; Address2: Halifax; Address3: NS; Address4: Canada B3H 0B2; SheetNumber: 5; SheetTotal: 9; SheetApproved: NO
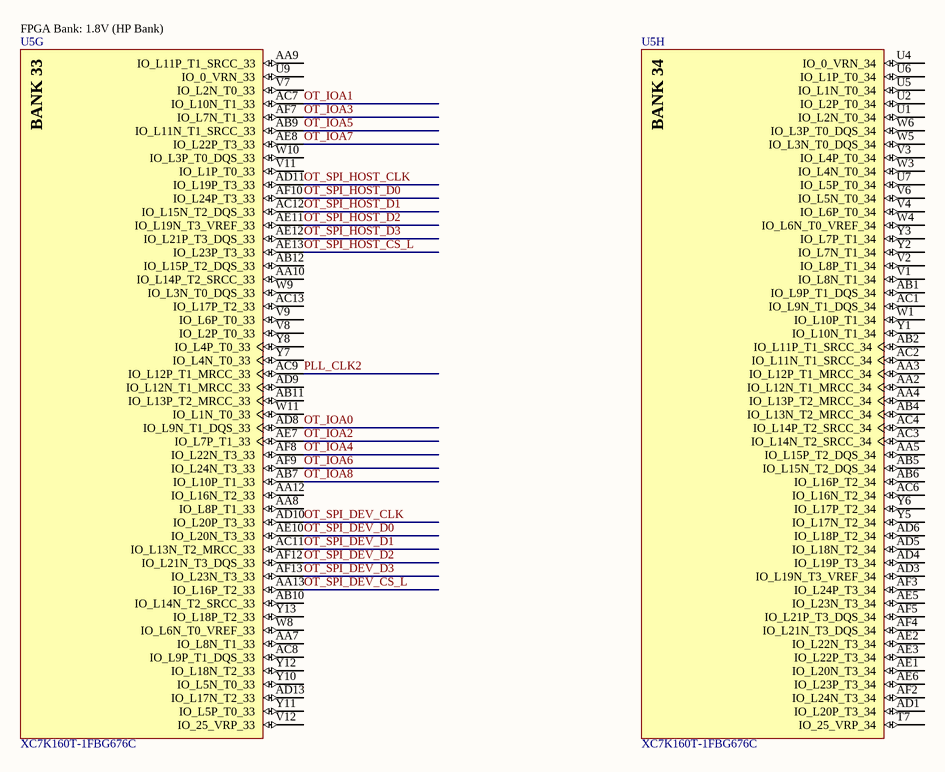
[diagram p4: CW342_FPGAIO_3.SchDoc]

### Parts
U5  XC7K160T-1FBG676C  [FBG676]  (parts G,H of 14)

### Nets
OT_IOA0: U5.AD8(IO_L9N_T1_DQS_33)
OT_IOA1: U5.AC7(IO_L10N_T1_33)
OT_IOA2: U5.AE7(IO_L7P_T1_33)
OT_IOA3: U5.AF7(IO_L7N_T1_33)
OT_IOA4: U5.AF8(IO_L22N_T3_33)
OT_IOA5: U5.AB9(IO_L11N_T1_SRCC_33)
OT_IOA6: U5.AF9(IO_L24N_T3_33)
OT_IOA7: U5.AE8(IO_L22P_T3_33)
OT_IOA8: U5.AB7(IO_L10P_T1_33)
OT_SPI_DEV_CLK: U5.AD10(IO_L20P_T3_33)
OT_SPI_DEV_CS_L: U5.AA13(IO_L16P_T2_33)
OT_SPI_DEV_D0: U5.AE10(IO_L20N_T3_33)
OT_SPI_DEV_D1: U5.AC11(IO_L13N_T2_MRCC_33)
OT_SPI_DEV_D2: U5.AF12(IO_L21N_T3_DQS_33)
OT_SPI_DEV_D3: U5.AF13(IO_L23N_T3_33)
OT_SPI_HOST_CLK: U5.AD11(IO_L19P_T3_33)
OT_SPI_HOST_CS_L: U5.AE13(IO_L23P_T3_33)
OT_SPI_HOST_D0: U5.AF10(IO_L24P_T3_33)
OT_SPI_HOST_D1: U5.AC12(IO_L15N_T2_DQS_33)
OT_SPI_HOST_D2: U5.AE11(IO_L19N_T3_VREF_33)
OT_SPI_HOST_D3: U5.AE12(IO_L21P_T3_DQS_33)
PLL_CLK2: U5.AC9(IO_L12P_T1_MRCC_33)

Not connected (* = marked no-connect by the designer): U5 AA2(IO_L12N_T1_MRCC_34) AA3(IO_L12P_T1_MRCC_34) AA4(IO_L13P_T2_MRCC_34) AA5(IO_L15P_T2_DQS_34) AA7(IO_L8N_T1_33) AA8(IO_L8P_T1_33) AA9(IO_L11P_T1_SRCC_33) AA10(IO_L14P_T2_SRCC_33) AA12(IO_L16N_T2_33) AB1(IO_L9P_T1_DQS_34) AB2(IO_L11P_T1_SRCC_34) AB4(IO_L13N_T2_MRCC_34) AB5(IO_L15N_T2_DQS_34) AB6(IO_L16P_T2_34) AB10(IO_L14N_T2_SRCC_33) AB11(IO_L13P_T2_MRCC_33) AB12(IO_L15P_T2_DQS_33) AC1(IO_L9N_T1_DQS_34) AC2(IO_L11N_T1_SRCC_34) AC3(IO_L14N_T2_SRCC_34) AC4(IO_L14P_T2_SRCC_34) AC6(IO_L16N_T2_34) AC8(IO_L9P_T1_DQS_33) AC13(IO_L17P_T2_33) AD1(IO_L20P_T3_34) AD3(IO_L19N_T3_VREF_34) AD4(IO_L19P_T3_34) AD5(IO_L18N_T2_34) AD6(IO_L18P_T2_34) AD9(IO_L12N_T1_MRCC_33) AD13(IO_L17N_T2_33) AE1(IO_L20N_T3_34) AE2(IO_L22N_T3_34) AE3(IO_L22P_T3_34) AE5(IO_L23N_T3_34) AE6(IO_L23P_T3_34) AF2(IO_L24N_T3_34) AF3(IO_L24P_T3_34) AF4(IO_L21N_T3_DQS_34) AF5(IO_L21P_T3_DQS_34) T7(IO_25_VRP_34) U1(IO_L2N_T0_34) U2(IO_L2P_T0_34) U4(IO_0_VRN_34) U5(IO_L1N_T0_34) U6(IO_L1P_T0_34) U7(IO_L5P_T0_34) U9(IO_0_VRN_33) V1(IO_L8N_T1_34) V2(IO_L8P_T1_34) V3(IO_L4P_T0_34) V4(IO_L6P_T0_34) V6(IO_L5N_T0_34) V7(IO_L2N_T0_33) V8(IO_L2P_T0_33) V9(IO_L6P_T0_33) V11(IO_L1P_T0_33) V12(IO_25_VRP_33) W1(IO_L10P_T1_34) W3(IO_L4N_T0_34) W4(IO_L6N_T0_VREF_34) W5(IO_L3N_T0_DQS_34) W6(IO_L3P_T0_DQS_34) W8(IO_L6N_T0_VREF_33) W9(IO_L3N_T0_DQS_33) W10(IO_L3P_T0_DQS_33) W11(IO_L1N_T0_33) Y1(IO_L10N_T1_34) Y2(IO_L7N_T1_34) Y3(IO_L7P_T1_34) Y5(IO_L17N_T2_34) Y6(IO_L17P_T2_34) Y7(IO_L4N_T0_33) Y8(IO_L4P_T0_33) Y10(IO_L5N_T0_33) Y11(IO_L5P_T0_33) Y12(IO_L18N_T2_33) Y13(IO_L18P_T2_33)

### Notes on the sheet
- (near U5) FPGA Bank: 1.8V (HP Bank)
- Title:
- Date:
- Rev:
- Time:
- Project:
- Sheet
- of
- License:
- Copyright © NewAE Technology Inc.
- Approved:
- NewAE.com
- File:
- (in symbol CMP-0361-00025-2, part G) BANK 33
- (in symbol CMP-0361-00025-2, part H) BANK 34

### Library data of the parts
U5 = CMP-0361-00025-2: as U5 on sheet CW342_FPGAIO_1; RoHS: Pb-Free; PackageReference: FBG676; Code_JEDEC: MS-034; Mounting Technology: Surface Mount; ComponentLink1URL: http://www.xilinx.com/support/documentation/data_sheets/ds180_7Series_Overview.pdf; DatasheetVersion: v1.12; Generic Part Number: XC7K160T; PartNumber: XC7K160T-1FBG676C; PackageVersion: Rev 1.8; ComponentLink2URL: http://www.xilinx.com/support/documentation/user_guides/ug475_7Series_Pkg_Pinout.pdf; PackageDescription: Flip-Chip Lidless BGA, Body 27 x 27 mm, 1.0 mm Pitch; ComponentLink1Description: Datasheet; ComponentLink2Description: Package Specification

## Sheet CW342_FPGA_MGT.SchDoc: <Enter Sheet Title>
size Letter; Organization: NewAE Technology Inc.; Address1: 1083 Queen St., Suite 196; Address2: Halifax; Address3: NS; Address4: Canada B3H 0B2; SheetNumber: 6; SheetTotal: 9; SheetApproved: NO
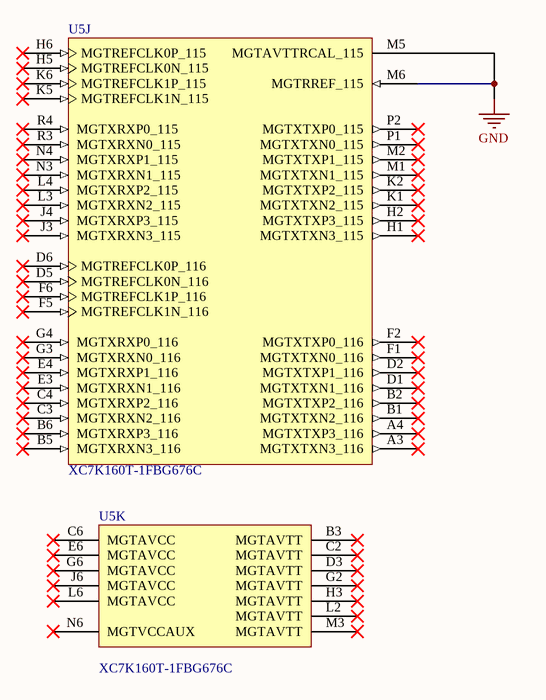
[diagram p5: CW342_FPGA_MGT.SchDoc]

### Parts
U5  XC7K160T-1FBG676C  [FBG676]  (parts J,K of 14)

### Nets
GND: U5.M5(MGTAVTTRCAL_115) U5.M6(MGTRREF_115)

Not connected (* = marked no-connect by the designer): U5 A3(MGTXTXN3_116)* A4(MGTXTXP3_116)* B1(MGTXTXN2_116)* B2(MGTXTXP2_116)* B3(MGTAVTT)* B5(MGTXRXN3_116)* B6(MGTXRXP3_116)* C2(MGTAVTT)* C3(MGTXRXN2_116)* C4(MGTXRXP2_116)* C6(MGTAVCC)* D1(MGTXTXN1_116)* D2(MGTXTXP1_116)* D3(MGTAVTT)* D5(MGTREFCLK0N_116)* D6(MGTREFCLK0P_116)* E3(MGTXRXN1_116)* E4(MGTXRXP1_116)* E6(MGTAVCC)* F1(MGTXTXN0_116)* F2(MGTXTXP0_116)* F5(MGTREFCLK1N_116)* F6(MGTREFCLK1P_116)* G2(MGTAVTT)* G3(MGTXRXN0_116)* G4(MGTXRXP0_116)* G6(MGTAVCC)* H1(MGTXTXN3_115)* H2(MGTXTXP3_115)* H3(MGTAVTT)* H5(MGTREFCLK0N_115)* H6(MGTREFCLK0P_115)* J3(MGTXRXN3_115)* J4(MGTXRXP3_115)* J6(MGTAVCC)* K1(MGTXTXN2_115)* K2(MGTXTXP2_115)* K5(MGTREFCLK1N_115)* K6(MGTREFCLK1P_115)* L2(MGTAVTT)* L3(MGTXRXN2_115)* L4(MGTXRXP2_115)* L6(MGTAVCC)* M1(MGTXTXN1_115)* M2(MGTXTXP1_115)* M3(MGTAVTT)* N3(MGTXRXN1_115)* N4(MGTXRXP1_115)* N6(MGTVCCAUX)* P1(MGTXTXN0_115)* P2(MGTXTXP0_115)* R3(MGTXRXN0_115)* R4(MGTXRXP0_115)*

### Notes on the sheet
- Title:
- Date:
- Rev:
- Time:
- Project:
- Sheet
- of
- License:
- Copyright © NewAE Technology Inc.
- Approved:
- NewAE.com
- File:

### Library data of the parts
U5 = CMP-0361-00025-2: as U5 on sheet CW342_FPGAIO_1; RoHS: Pb-Free; PackageReference: FBG676; Code_JEDEC: MS-034; Mounting Technology: Surface Mount; ComponentLink1URL: http://www.xilinx.com/support/documentation/data_sheets/ds180_7Series_Overview.pdf; DatasheetVersion: v1.12; Generic Part Number: XC7K160T; PartNumber: XC7K160T-1FBG676C; PackageVersion: Rev 1.8; ComponentLink2URL: http://www.xilinx.com/support/documentation/user_guides/ug475_7Series_Pkg_Pinout.pdf; PackageDescription: Flip-Chip Lidless BGA, Body 27 x 27 mm, 1.0 mm Pitch; ComponentLink1Description: Datasheet; ComponentLink2Description: Package Specification

## Sheet CW342_FPGA_CFG.SchDoc: <Enter Sheet Title>
size Letter; Organization: NewAE Technology Inc.; Address1: 1083 Queen St., Suite 196; Address2: Halifax; Address3: NS; Address4: Canada B3H 0B2; SheetNumber: 7; SheetTotal: 9; SheetApproved: NO
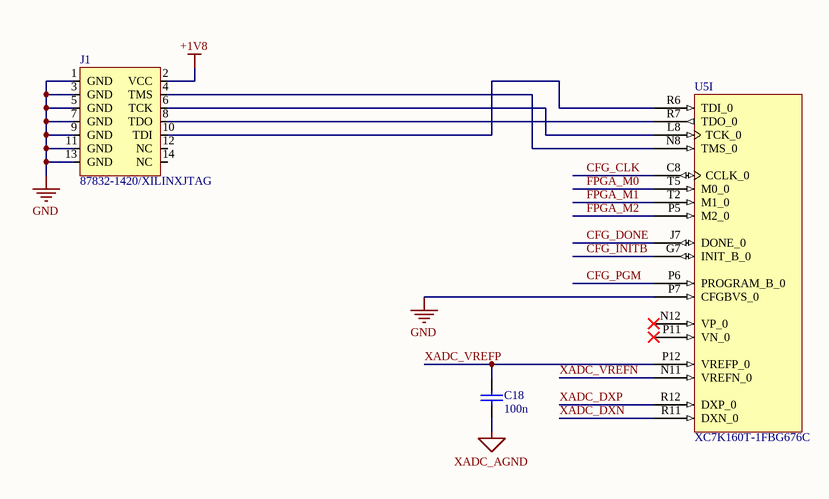
[diagram p6: CW342_FPGA_CFG.SchDoc]

### Parts
C18  100n  [CAPC0402_M]
J1  87832-1420/XILINXJTAG  [87832-1420]
U5  XC7K160T-1FBG676C  [FBG676]  (part I of 14)

### Nets
+1V8: J1.2(VCC)
GND: J1.1(GND) J1.3(GND) J1.5(GND) J1.7(GND) J1.9(GND) J1.11(GND) J1.13(GND) U5.P7(CFGBVS_0)
XADC_VREFN: C18.2 U5.N11(VREFN_0)  [also labelled XADC_AGND]
CFG_CLK: U5.C8(CCLK_0)
CFG_DONE: U5.J7(DONE_0)
CFG_INITB: U5.G7(INIT_B_0)
CFG_PGM: U5.P6(PROGRAM_B_0)
FPGA_M0: U5.T5(M0_0)
FPGA_M1: U5.T2(M1_0)
FPGA_M2: U5.P5(M2_0)
XADC_DXN: U5.R11(DXN_0)
XADC_DXP: U5.R12(DXP_0)
XADC_VREFP: C18.1 U5.P12(VREFP_0)
NetJ1_4: J1.4(TMS) U5.N8(TMS_0)
NetJ1_6: J1.6(TCK) U5.L8(TCK_0)
NetJ1_8: J1.8(TDO) U5.R7(TDO_0)
NetJ1_10: J1.10(TDI) U5.R6(TDI_0)

Not connected (* = marked no-connect by the designer): J1 12(NC) 14(NC); U5 N12(VP_0)* P11(VN_0)*

### Notes on the sheet
- Title:
- Date:
- Rev:
- Time:
- Project:
- Sheet
- of
- License:
- Copyright © NewAE Technology Inc.
- Approved:
- NewAE.com
- File:

### Library data of the parts
C18 = CCHIP-100n-0402: as C1 on sheet CW342_XADC; Part Number: CCHIP-100n-0402; Footprint: 0402; Pin Count: 2; Value: 100n; Mounting Technology: SMT; Component Kind: Standard; Component Type: Standard; Supplier 1: Digi-Key; Supplier Part Number 1: 445-6901-1-ND
J1 = 87832-1420/XILINXJTAG: Molex 14-pin SMD, JTAG Pinout; Manufacture 1: Molex; Manufacture 1 Part Number: 87832-1420; Supplier 1: Digi-Key; Supplier Part Number 1: WM18641-ND
U5 = CMP-0361-00025-2: as U5 on sheet CW342_FPGAIO_1; RoHS: Pb-Free; PackageReference: FBG676; Code_JEDEC: MS-034; Mounting Technology: Surface Mount; ComponentLink1URL: http://www.xilinx.com/support/documentation/data_sheets/ds180_7Series_Overview.pdf; DatasheetVersion: v1.12; Generic Part Number: XC7K160T; PartNumber: XC7K160T-1FBG676C; PackageVersion: Rev 1.8; ComponentLink2URL: http://www.xilinx.com/support/documentation/user_guides/ug475_7Series_Pkg_Pinout.pdf; PackageDescription: Flip-Chip Lidless BGA, Body 27 x 27 mm, 1.0 mm Pitch; ComponentLink1Description: Datasheet; ComponentLink2Description: Package Specification

## Sheet CW342_FPGA_PWR.SchDoc: <Enter Sheet Title>
size Letter; Organization: NewAE Technology Inc.; Address1: 1083 Queen St., Suite 196; Address2: Halifax; Address3: NS; Address4: Canada B3H 0B2; SheetNumber: 8; SheetTotal: 9; SheetApproved: NO
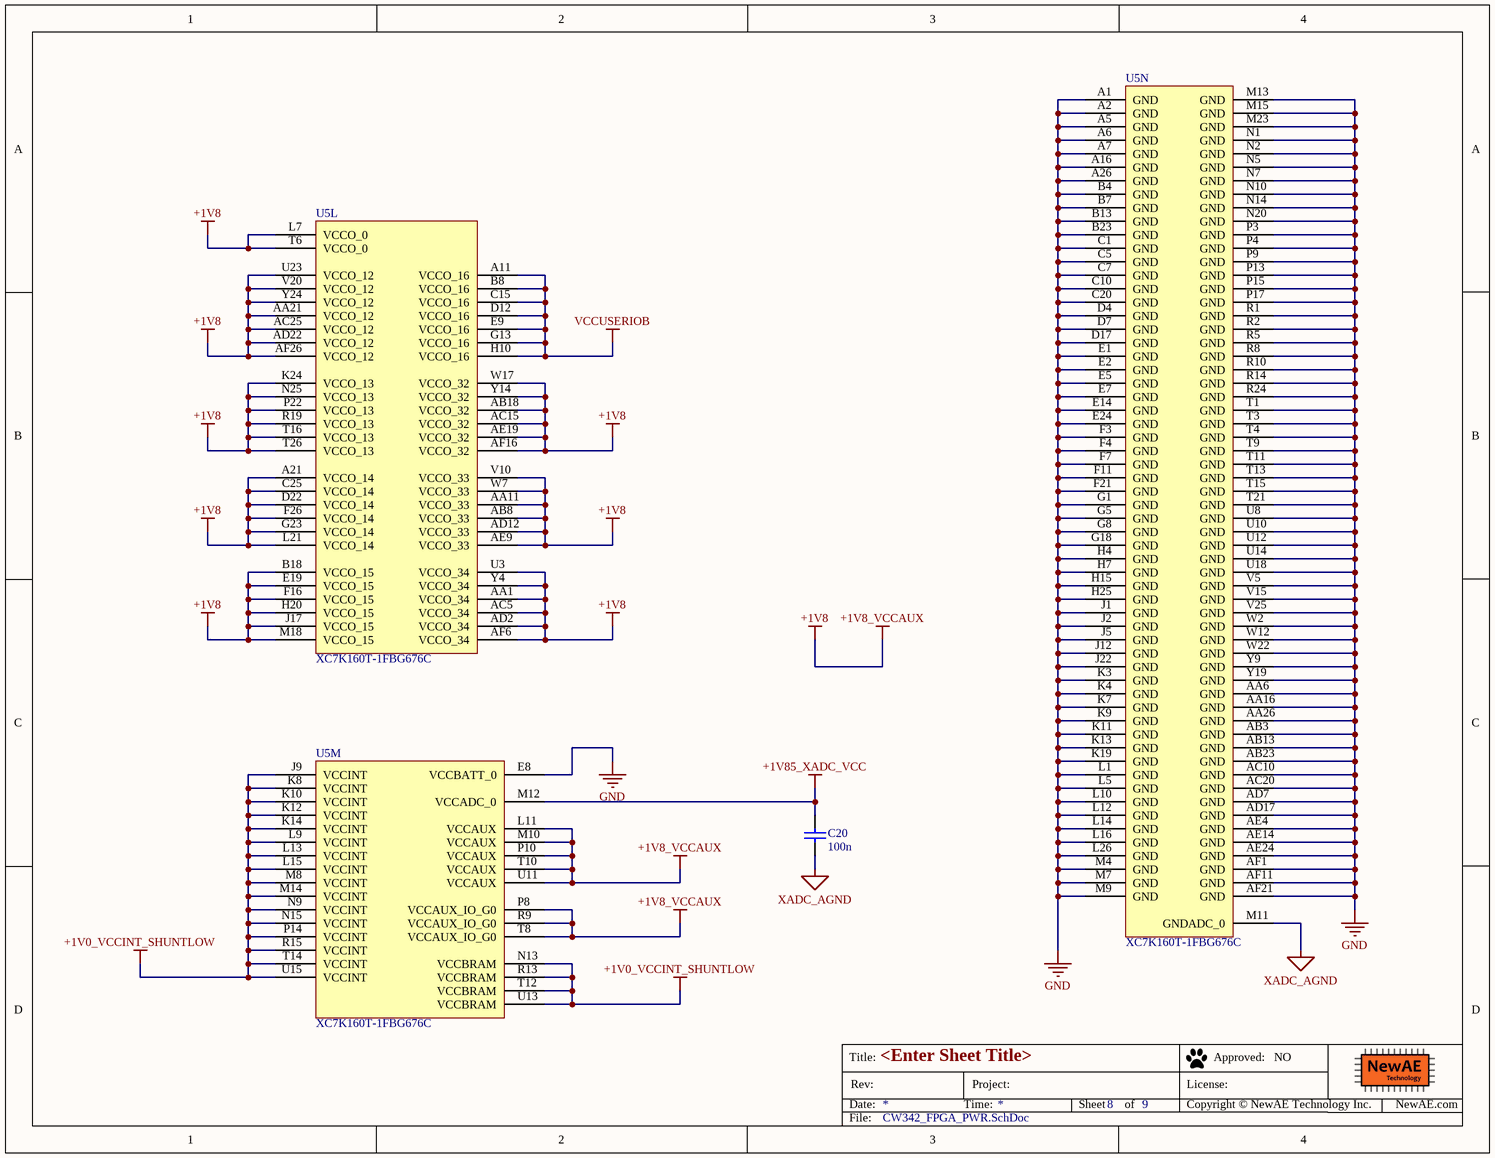
[diagram p7: CW342_FPGA_PWR.SchDoc]

### Parts
C20  100n  [CAPC0402_M]
U5  XC7K160T-1FBG676C  [FBG676]  (parts L,M,N of 14)

### Nets
+1V0_VCCINT_SHUNTLOW: U5.J9(VCCINT) U5.K8(VCCINT) U5.K10(VCCINT) U5.K12(VCCINT) U5.K14(VCCINT) U5.L9(VCCINT) U5.L13(VCCINT) U5.L15(VCCINT) U5.M8(VCCINT) U5.M14(VCCINT) U5.N9(VCCINT) U5.N13(VCCBRAM) U5.N15(VCCINT) U5.P14(VCCINT) U5.R13(VCCBRAM) U5.R15(VCCINT) U5.T12(VCCBRAM) U5.T14(VCCINT) U5.U13(VCCBRAM) U5.U15(VCCINT)
+1V8: U5.A21(VCCO_14) U5.AA1(VCCO_34) U5.AA11(VCCO_33) U5.AA21(VCCO_12) U5.AB8(VCCO_33) U5.AB18(VCCO_32) U5.AC5(VCCO_34) U5.AC15(VCCO_32) U5.AC25(VCCO_12) U5.AD2(VCCO_34) U5.AD12(VCCO_33) U5.AD22(VCCO_12) U5.AE9(VCCO_33) U5.AE19(VCCO_32) U5.AF6(VCCO_34) U5.AF16(VCCO_32) U5.AF26(VCCO_12) U5.B18(VCCO_15) U5.C25(VCCO_14) U5.D22(VCCO_14) U5.E19(VCCO_15) U5.F16(VCCO_15) U5.F26(VCCO_14) U5.G23(VCCO_14) U5.H20(VCCO_15) U5.J17(VCCO_15) U5.K24(VCCO_13) U5.L7(VCCO_0) U5.L11(VCCAUX) U5.L21(VCCO_14) U5.M10(VCCAUX) U5.M18(VCCO_15) U5.N25(VCCO_13) U5.P8(VCCAUX_IO_G0) U5.P10(VCCAUX) U5.P22(VCCO_13) U5.R9(VCCAUX_IO_G0) U5.R19(VCCO_13) U5.T6(VCCO_0) U5.T8(VCCAUX_IO_G0) U5.T10(VCCAUX) U5.T16(VCCO_13) U5.T26(VCCO_13) U5.U3(VCCO_34) U5.U11(VCCAUX) U5.U23(VCCO_12) U5.V10(VCCO_33) U5.V20(VCCO_12) U5.W7(VCCO_33) U5.W17(VCCO_32) U5.Y4(VCCO_34) U5.Y14(VCCO_32) U5.Y24(VCCO_12)  [also labelled +1V8_VCCAUX]
+1V85_XADC_VCC: C20.1 U5.M12(VCCADC_0)
GND: U5.A1(GND) U5.A2(GND) U5.A5(GND) U5.A6(GND) U5.A7(GND) U5.A16(GND) U5.A26(GND) U5.AA6(GND) U5.AA16(GND) U5.AA26(GND) U5.AB3(GND) U5.AB13(GND) U5.AB23(GND) U5.AC10(GND) U5.AC20(GND) U5.AD7(GND) U5.AD17(GND) U5.AE4(GND) U5.AE14(GND) U5.AE24(GND) U5.AF1(GND) U5.AF11(GND) U5.AF21(GND) U5.B4(GND) U5.B7(GND) U5.B13(GND) U5.B23(GND) U5.C1(GND) U5.C5(GND) U5.C7(GND) U5.C10(GND) U5.C20(GND) U5.D4(GND) U5.D7(GND) U5.D17(GND) U5.E1(GND) U5.E2(GND) U5.E5(GND) U5.E7(GND) U5.E8(VCCBATT_0) U5.E14(GND) U5.E24(GND) U5.F3(GND) U5.F4(GND) U5.F7(GND) U5.F11(GND) U5.F21(GND) U5.G1(GND) U5.G5(GND) U5.G8(GND) U5.G18(GND) U5.H4(GND) U5.H7(GND) U5.H15(GND) U5.H25(GND) U5.J1(GND) U5.J2(GND) U5.J5(GND) U5.J12(GND) U5.J22(GND) U5.K3(GND) U5.K4(GND) U5.K7(GND) U5.K9(GND) U5.K11(GND) U5.K13(GND) U5.K19(GND) U5.L1(GND) U5.L5(GND) U5.L10(GND) U5.L12(GND) U5.L14(GND) U5.L16(GND) U5.L26(GND) U5.M4(GND) U5.M7(GND) U5.M9(GND) U5.M13(GND) U5.M15(GND) U5.M23(GND) U5.N1(GND) U5.N2(GND) U5.N5(GND) U5.N7(GND) U5.N10(GND) U5.N14(GND) U5.N20(GND) U5.P3(GND) U5.P4(GND) U5.P9(GND) U5.P13(GND) U5.P15(GND) U5.P17(GND) U5.R1(GND) U5.R2(GND) U5.R5(GND) U5.R8(GND) U5.R10(GND) U5.R14(GND) U5.R24(GND) U5.T1(GND) U5.T3(GND) U5.T4(GND) U5.T9(GND) U5.T11(GND) U5.T13(GND) U5.T15(GND) U5.T21(GND) U5.U8(GND) U5.U10(GND) U5.U12(GND) U5.U14(GND) U5.U18(GND) U5.V5(GND) U5.V15(GND) U5.V25(GND) U5.W2(GND) U5.W12(GND) U5.W22(GND) U5.Y9(GND) U5.Y19(GND)
VCCUSERIOB: U5.A11(VCCO_16) U5.B8(VCCO_16) U5.C15(VCCO_16) U5.D12(VCCO_16) U5.E9(VCCO_16) U5.G13(VCCO_16) U5.H10(VCCO_16)
XADC_AGND: C20.2 U5.M11(GNDADC_0)  [project net XADC_VREFN]

### Notes on the sheet
- Title:
- Date:
- Rev:
- Time:
- Project:
- Sheet
- of
- License:
- Copyright © NewAE Technology Inc.
- Approved:
- NewAE.com
- File:

### Library data of the parts
C20 = CCHIP-100n-0402: as C1 on sheet CW342_XADC; Part Number: CCHIP-100n-0402; Footprint: 0402; Pin Count: 2; Value: 100n; Mounting Technology: SMT; Component Kind: Standard; Component Type: Standard; Supplier 1: Digi-Key; Supplier Part Number 1: 445-6901-1-ND
U5 = CMP-0361-00025-2: as U5 on sheet CW342_FPGAIO_1; RoHS: Pb-Free; PackageReference: FBG676; Code_JEDEC: MS-034; Mounting Technology: Surface Mount; ComponentLink1URL: http://www.xilinx.com/support/documentation/data_sheets/ds180_7Series_Overview.pdf; DatasheetVersion: v1.12; Generic Part Number: XC7K160T; PartNumber: XC7K160T-1FBG676C; PackageVersion: Rev 1.8; ComponentLink2URL: http://www.xilinx.com/support/documentation/user_guides/ug475_7Series_Pkg_Pinout.pdf; PackageDescription: Flip-Chip Lidless BGA, Body 27 x 27 mm, 1.0 mm Pitch; ComponentLink1Description: Datasheet; ComponentLink2Description: Package Specification

## Sheet CW342_FPGA_DECOUP.SchDoc: <Enter Sheet Title>
size Letter; Organization: NewAE Technology Inc.; Address1: 1083 Queen St., Suite 196; Address2: Halifax; Address3: NS; Address4: Canada B3H 0B2; SheetNumber: 9; SheetTotal: 9; SheetApproved: NO
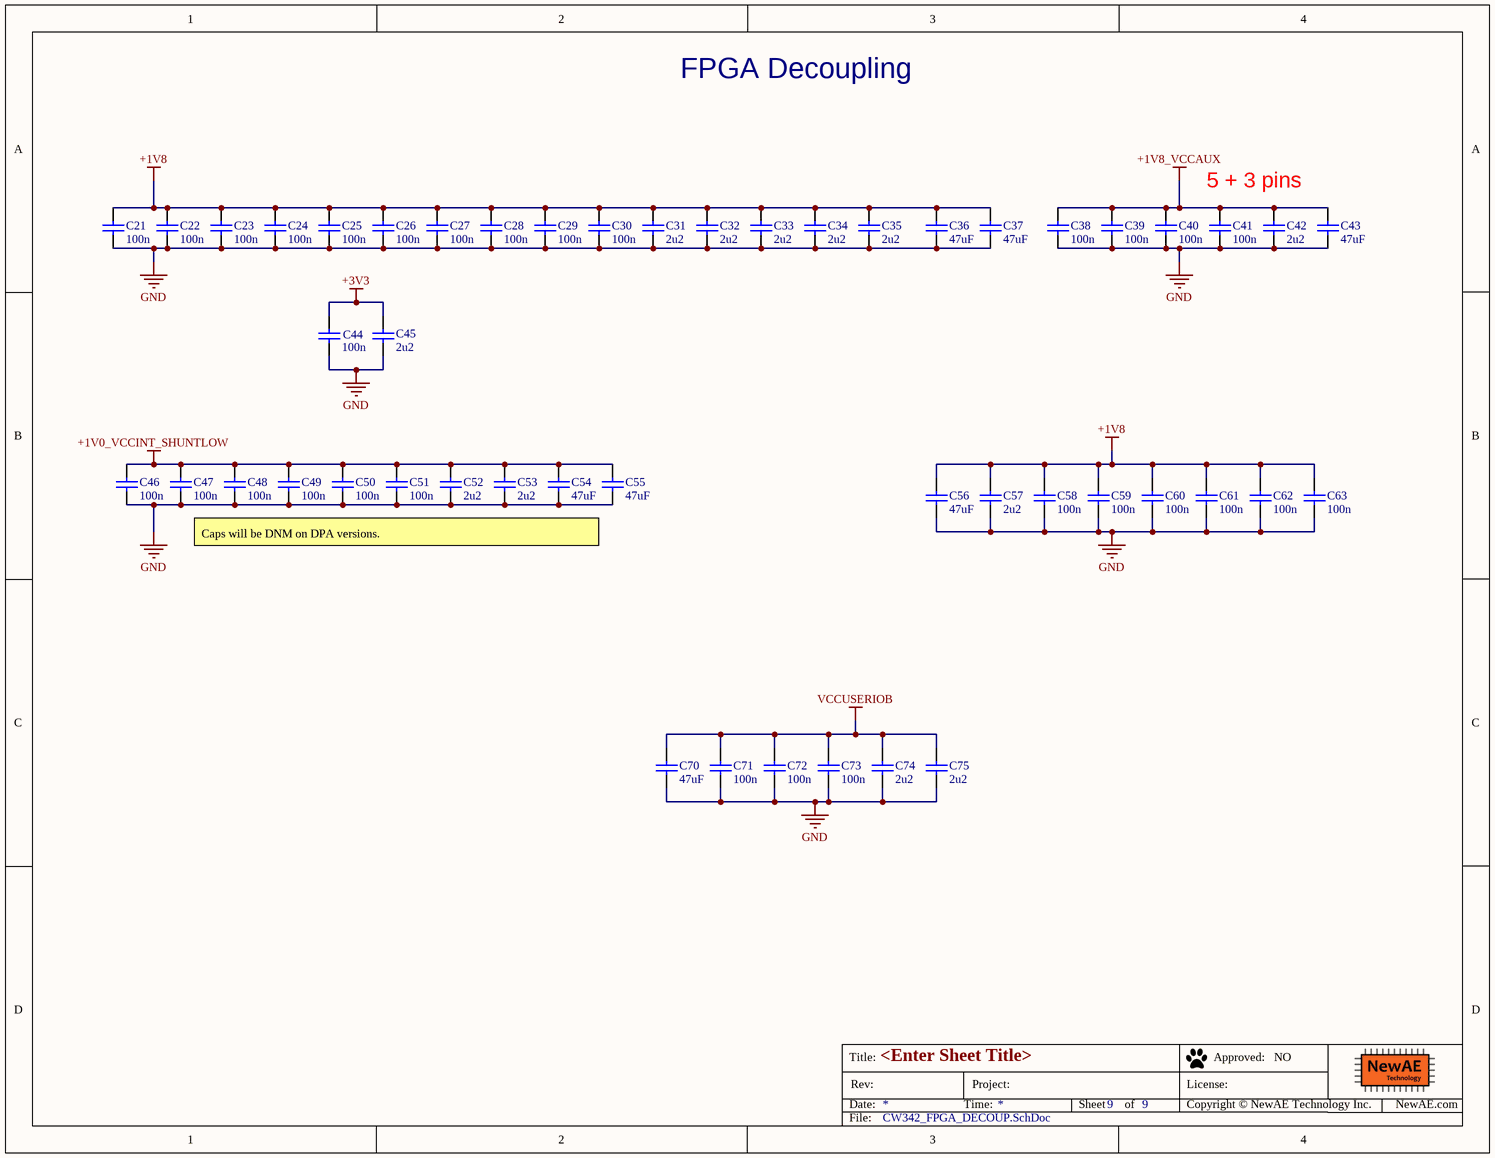
[diagram p8: CW342_FPGA_DECOUP.SchDoc]

### Parts
C21  100n  [CAPC0402_M]
C22  100n  [CAPC0402_M]
C23  100n  [CAPC0402_M]
C24  100n  [CAPC0402_M]
C25  100n  [CAPC0402_M]
C26  100n  [CAPC0402_M]
C27  100n  [CAPC0402_M]
C28  100n  [CAPC0402_M]
C29  100n  [CAPC0402_M]
C30  100n  [CAPC0402_M]
C31  2u2  [CAPC0603_M]
C32  2u2  [CAPC0603_M]
C33  2u2  [CAPC0603_M]
C34  2u2  [CAPC0603_M]
C35  2u2  [CAPC0603_M]
C36  47uF  [CAPC3225X20N]
C37  47uF  [CAPC3225X20N]
C38  100n  [CAPC0402_M]
C39  100n  [CAPC0402_M]
C40  100n  [CAPC0402_M]
C41  100n  [CAPC0402_M]
C42  2u2  [CAPC0603_M]
C43  47uF  [CAPC3225X20N]
C44  100n  [CAPC0402_M]
C45  2u2  [CAPC0603_M]
C46  100n  [CAPC0402_M]
C47  100n  [CAPC0402_M]
C48  100n  [CAPC0402_M]
C49  100n  [CAPC0402_M]
C50  100n  [CAPC0402_M]
C51  100n  [CAPC0402_M]
C52  2u2  [CAPC0603_M]
C53  2u2  [CAPC0603_M]
C54  47uF  [CAPC3225X20N]
C55  47uF  [CAPC3225X20N]
C56  47uF  [CAPC3225X20N]
C57  2u2  [CAPC0603_M]
C58  100n  [CAPC0402_M]
C59  100n  [CAPC0402_M]
C60  100n  [CAPC0402_M]
C61  100n  [CAPC0402_M]
C62  100n  [CAPC0402_M]
C63  100n  [CAPC0402_M]
C70  47uF  [CAPC3225X20N]
C71  100n  [CAPC0402_M]
C72  100n  [CAPC0402_M]
C73  100n  [CAPC0402_M]
C74  2u2  [CAPC0603_M]
C75  2u2  [CAPC0603_M]

### Nets
+1V0_VCCINT_SHUNTLOW: C46.1 C47.1 C48.1 C49.1 C50.1 C51.1 C52.1 C53.1 C54.1 C55.1
+1V8: C21.1 C22.1 C23.1 C24.1 C25.1 C26.1 C27.1 C28.1 C29.1 C30.1 C31.1 C32.1 C33.1 C34.1 C35.1 C36.1 C37.1 C38.1 C39.1 C40.1 C41.1 C42.1 C43.1 C56.1 C57.1 C58.1 C59.1 C60.1 C61.1 C62.1 C63.1  [also labelled +1V8_VCCAUX]
+3V3: C44.1 C45.1
GND: C21.2 C22.2 C23.2 C24.2 C25.2 C26.2 C27.2 C28.2 C29.2 C30.2 C31.2 C32.2 C33.2 C34.2 C35.2 C36.2 C37.2 C38.2 C39.2 C40.2 C41.2 C42.2 C43.2 C44.2 C45.2 C46.2 C47.2 C48.2 C49.2 C50.2 C51.2 C52.2 C53.2 C54.2 C55.2 C56.2 C57.2 C58.2 C59.2 C60.2 C61.2 C62.2 C63.2 C70.2 C71.2 C72.2 C73.2 C74.2 C75.2
VCCUSERIOB: C70.1 C71.1 C72.1 C73.1 C74.1 C75.1

### Notes on the sheet
- FPGA Decoupling
- 5 + 3 pins
- Caps will be DNM on DPA versions.
- Title:
- Date:
- Rev:
- Time:
- Project:
- Sheet
- of
- License:
- Copyright © NewAE Technology Inc.
- Approved:
- NewAE.com
- File:

### Library data of the parts
C21-C30 C38-C41 C44 C46-C51 C58-C63 C71-C73 = CCHIP-100n-0402: as C1 on sheet CW342_XADC; Part Number: CCHIP-100n-0402; Footprint: 0402; Pin Count: 2; Value: 100n; Mounting Technology: SMT; Component Kind: Standard; Component Type: Standard; Supplier 1: Digi-Key; Supplier Part Number 1: 445-6901-1-ND
C31-C35 C42 C45 C52 C53 C57 C74 C75 = CCHIP-2u2-0603: 2u2, 0603; Manufacture 1: Samsung; Manufacture Part Number 1: CL10B225KP8NNNC; Component Group: Capacitor; Case-EIA: 0603; Case-Metric: 1608; Rated Voltage: 10VDC; Part Number: CCHIP-2u2-0603; Footprint: 0603; Pin Count: 2; Supplier 1: Digi-Key; Supplier Part Number 1: 1276-1134-1-ND; Value: 2u2; Mounting Technology: SMT; Component Kind: Standard; Component Type: Standard
C36 C37 C43 C54-C56 C70 = CCHIP-47u-1210: 47u, 10V, 1210, Ceramic; Manufacture 1: TDK Corporation; Manufacture Part Number 1: C3225X5R1A476M250AC; Component Group: Capacitor; Case-EIA: 1210; Case-Metric: 3225; Rated Voltage: 10VDC; Tolerance: 20%; Part Number: CCHIP-47u-1210; Footprint: 1210; Pin Count: 2; Supplier 1: Digi-Key; Supplier Part Number 1: 445-6711-1-ND; Value: 47uF; Mounting Technology: SMT; Temperature Range: -55C to 85C; Component Kind: Standard; Component Type: Standard